# EasyEDA Pro project Ai-Camera.eprj, board PCB1
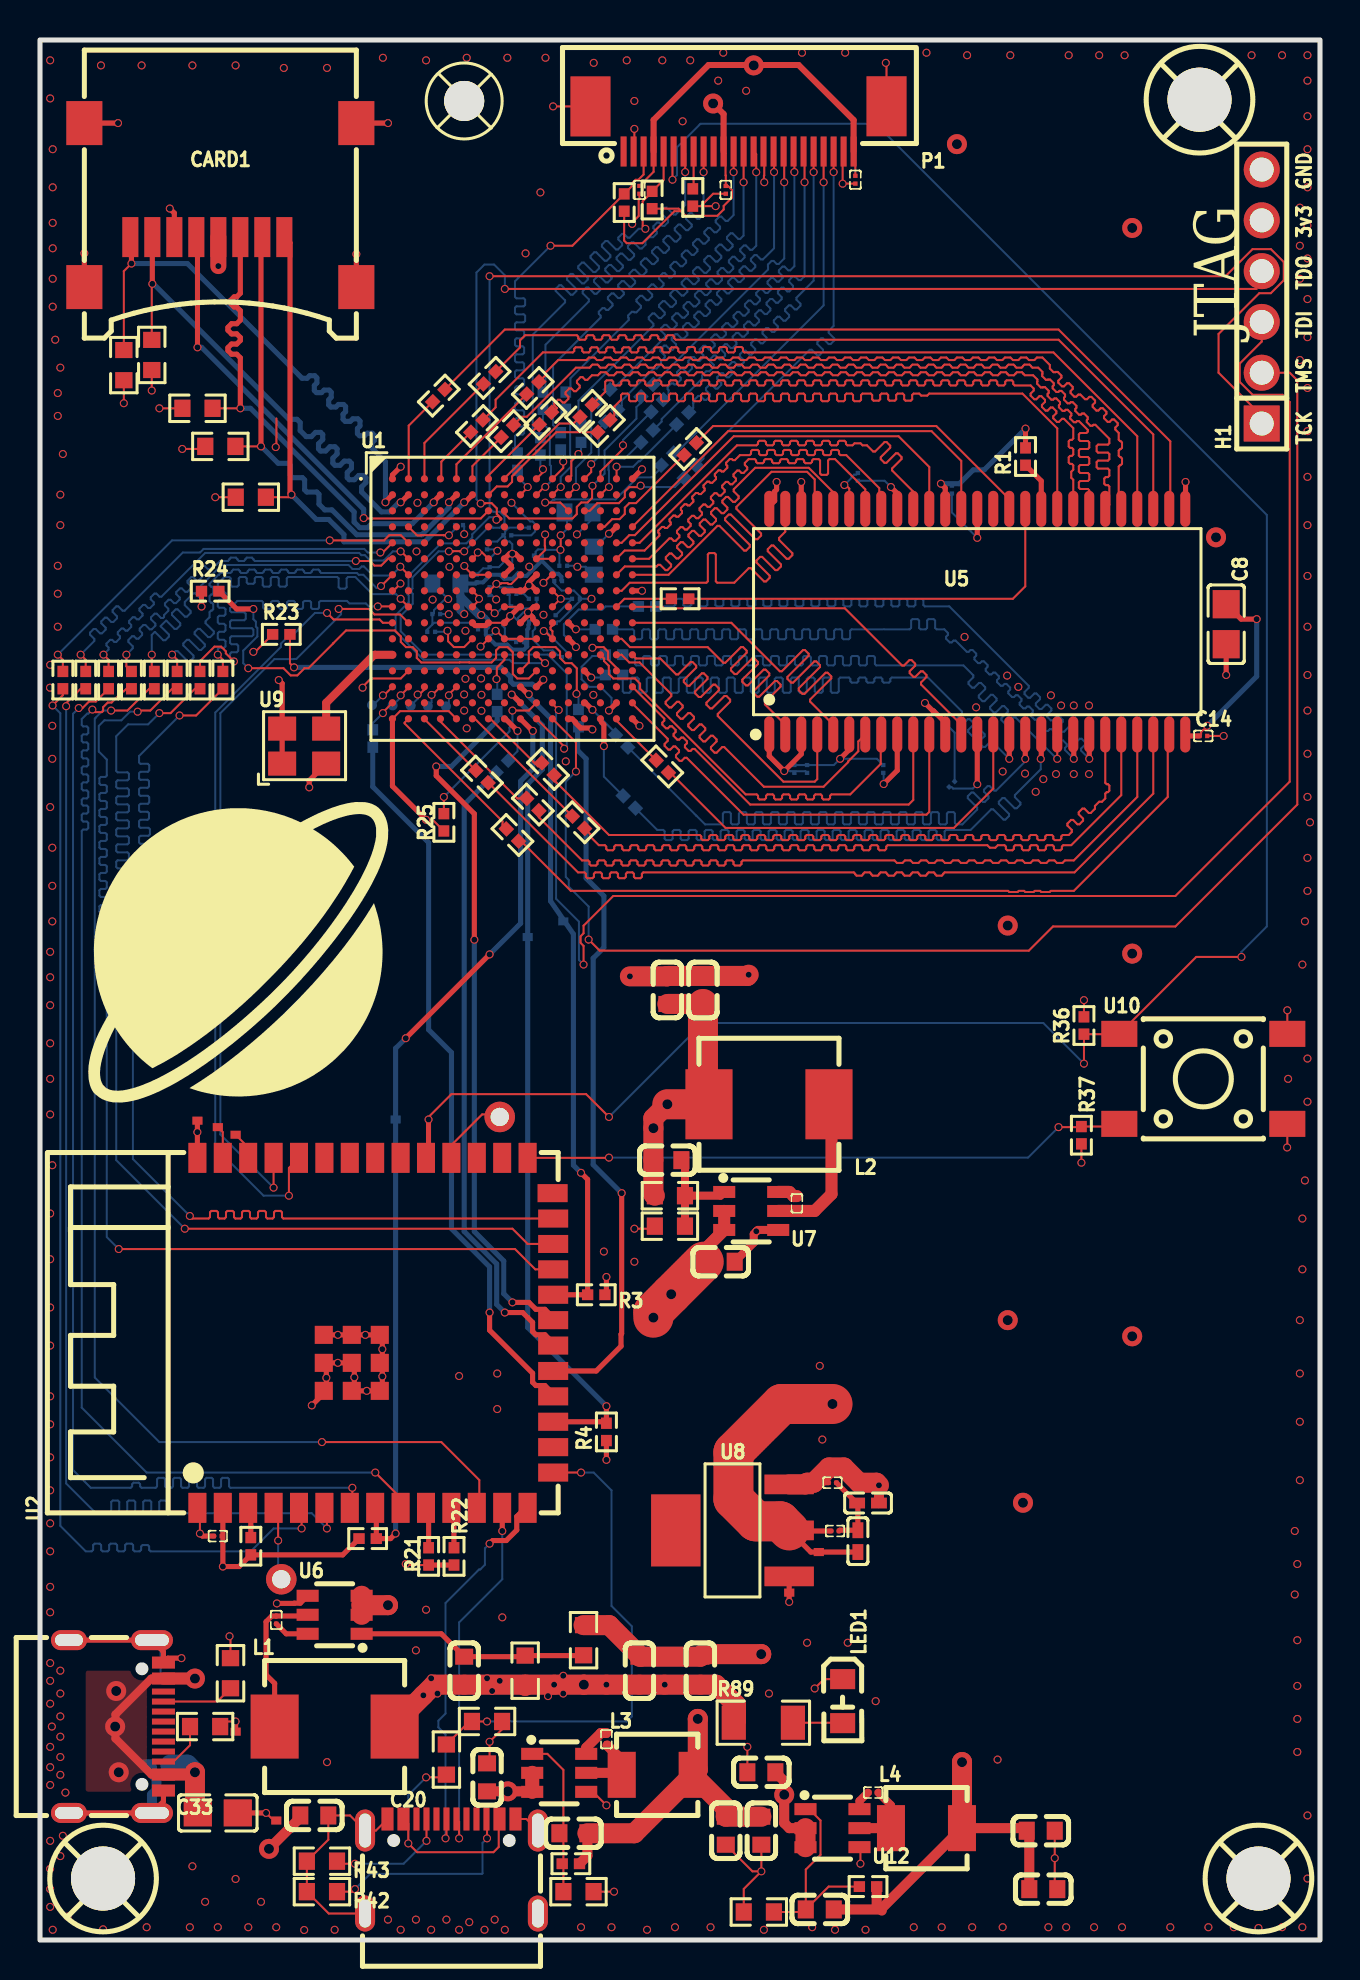
[diagram p2: board, top side]
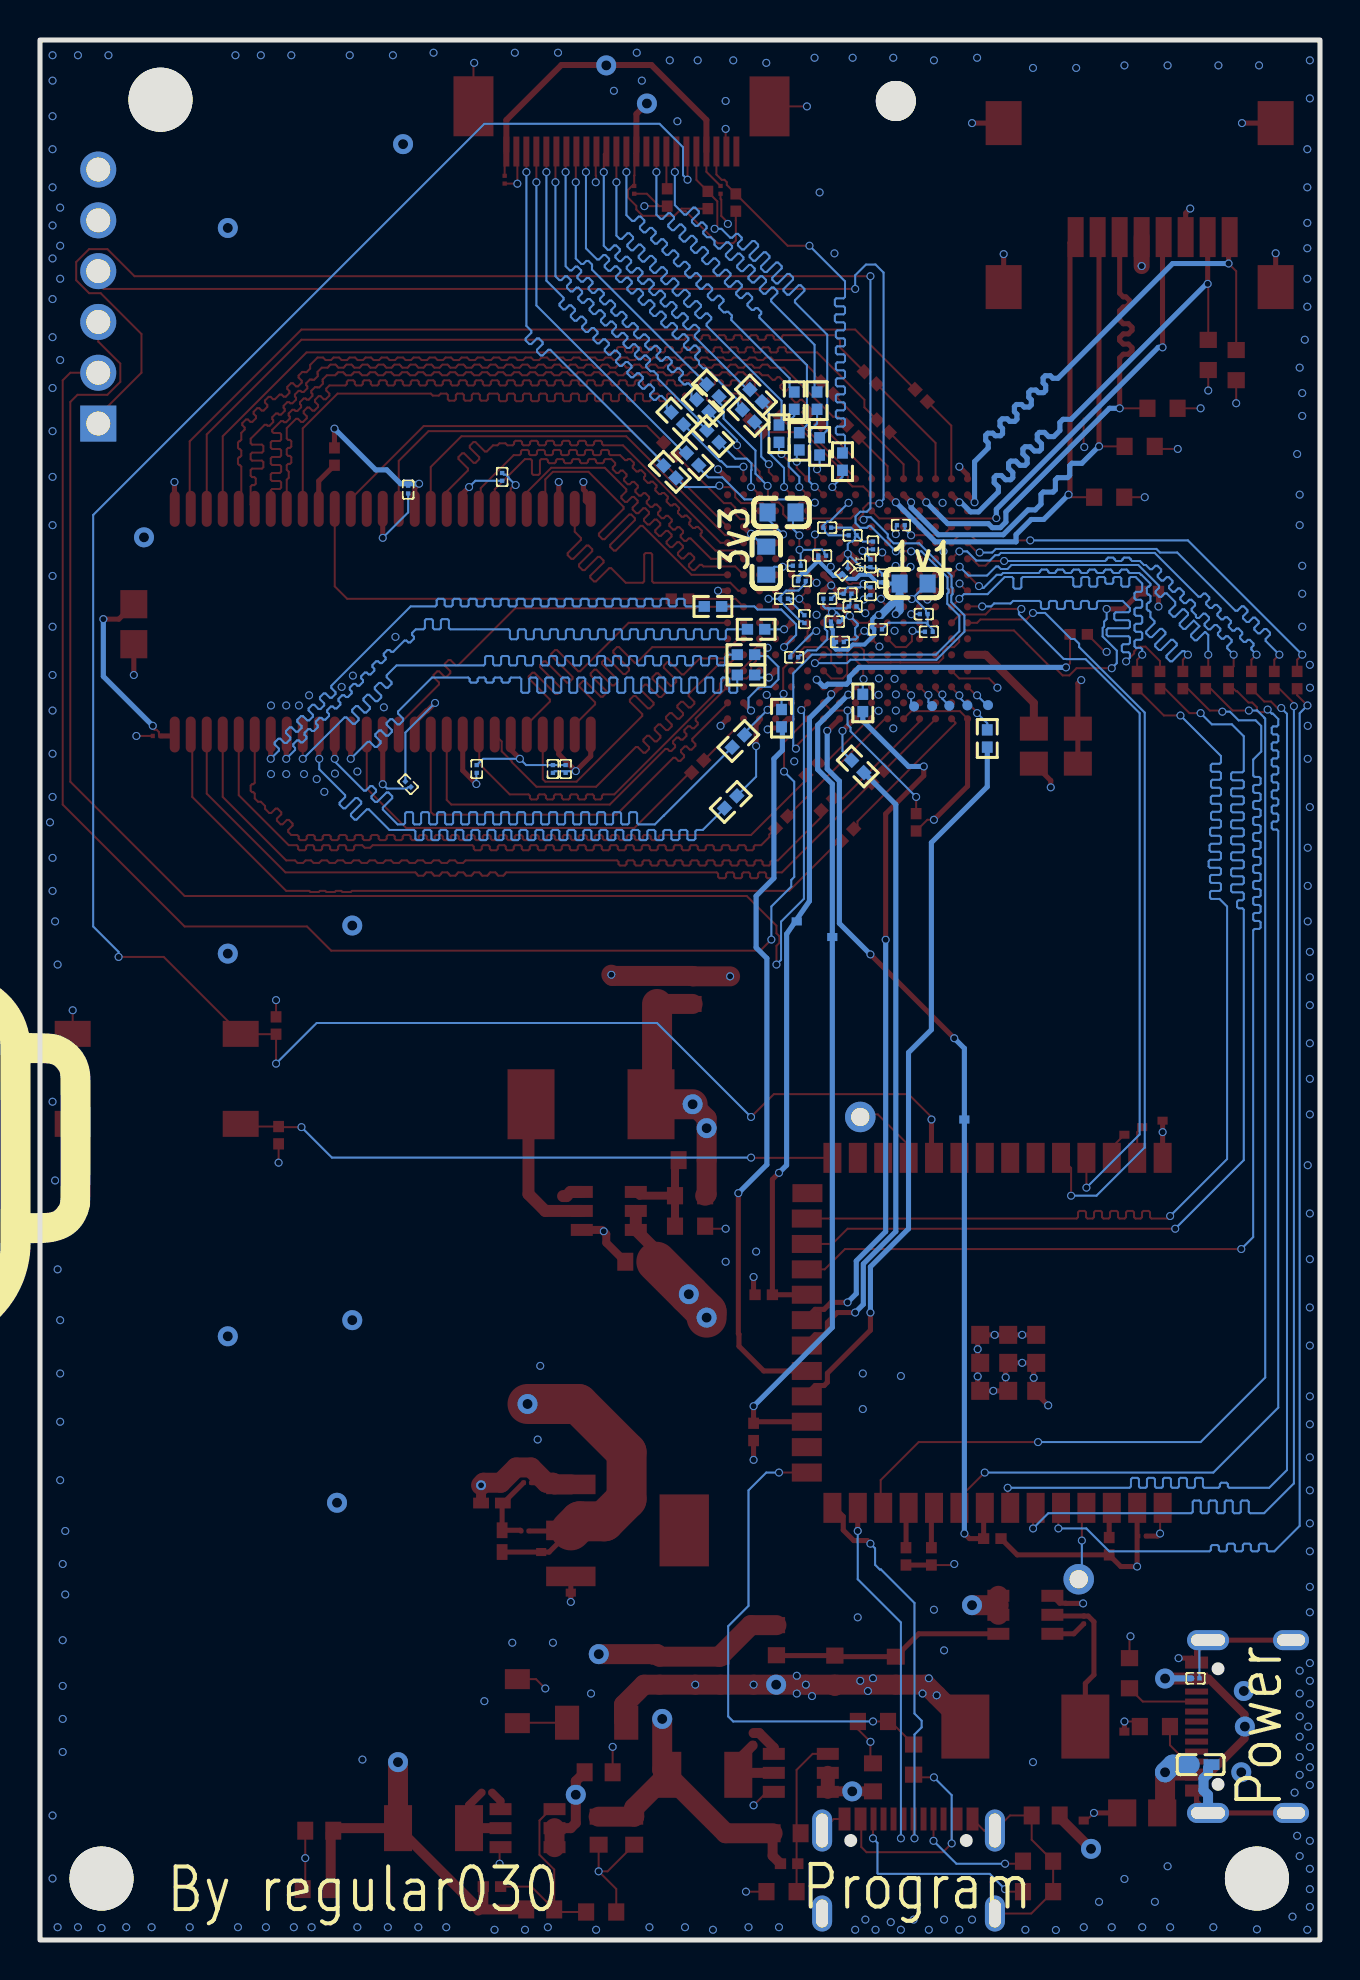
[diagram p3: board, bottom side, seen from below]

Outline 64 x 95 mm; copper layers: Top Layer, Inner1, Inner2, Inner3, Inner4, Bottom Layer. Coordinates in mm from the lower left corner of the outline.
Outline path: rectangle 0,95 64,0
Stack: Top Layer 0.035mm Outer layer thickness 1oz / Dielectric1 0.0994mm 3313 RC57% 4.2mil / Inner1 0.0152mm Inner layer thickness / Dielectric2 0.55mm 0.55mm H/H No copper / Inner2 0.0152mm Inner layer thickness / Dielectric3 0.1088mm 2116 RC54% 4.9mil / Inner3 0.0152mm Inner layer thickness / Dielectric4 0.55mm 0.55mm H/H No copper / Inner4 0.0152mm Inner layer thickness / Dielectric5 0.0994mm 3313 RC57% 4.2mil / Bottom Layer 0.035mm Outer layer thickness 1oz

## Design rules (mm)
template: Custom Config
spacing copperThickness1oz (default): track to track 0.1, other pairs 0.152 to 0.3
spacing copperThickness2oz: track to track 0.203, other pairs 0.152 to 0.3
track width copperThickness1oz (default): min 0.1, default 0.1, max 2.54
track width copperThickness2oz: min 0.203, default 0.254, max 2.54
differential pair differentialPair (default): width min 0.127, default 0.254, max 2.54; gap min 0.152, default 0.152
via viaSize (default): diameter min 0.4, default 0.4, max 10; hole min 0.3, default 0.3, max 6.3

## Placement (name value [footprint] x y rotation side)
C8  47uF  [C0805]  59.31 65.79 270 top
C10  100nF  [C01005]  37.72 58.55 90 bottom
C11  100nF  [C01005]  38.35 58.55 90 bottom
C12  100nF  [C01005]  42.16 58.55 90 bottom
C13  100nF  [C01005]  45.59 57.79 45 bottom
C14  100nF  [C01005]  58.17 60.2 0 top
C15  100nF  [C01005]  45.59 72.52 90 bottom
C16  100nF  [C01005]  40.89 73.16 90 bottom
C17  100nF  [C01005]  8.89 20.2 0 top
C18  100nF  [C01005]  11.81 16.01 90 top
C19  100nF  [C0603]  21.21 13.47 270 top
C20  22uF  [C0603]  13.72 6.23 180 top
C22  22uF  [C0603]  33.02 13.47 270 top
C23  22uF  [C0603]  29.97 13.47 270 top
C24  100nF  [C01005]  37.85 36.83 270 top
C25  100nF  [C0603]  31.37 38.99 180 top
C26  22uF  [C0603]  34.04 33.91 180 top
C27  22uF  [C0603]  31.37 47.5 270 top
C28  22uF  [C0603]  33.15 47.5 270 top
C29  100nF  [C01005]  39.75 20.45 0 top
C30  100nF  [C01005]  39.62 22.86 0 top
C31  10uF  [C0402]  41.4 21.85 0 top
C32  10uF  [C0402]  40.89 19.94 270 top
C33  47uF  [C0805]  8.89 6.35 180 top
C34  100nF  [C01005]  29.97 87.51 270 top
C35  100nF  [C01005]  34.29 87.51 270 top
C37  100nF  [C01005]  20.96 70.74 180 bottom
C39  100nF  [C01005]  24.64 70.62 180 bottom
C40  100nF  [C01005]  26.16 68.71 180 bottom
C41  100nF  [C01005]  21.84 68.08 90 bottom
C42  100nF  [C01005]  23.75 68.46 135 bottom
C43  100nF  [C01005]  24.89 69.22 180 bottom
C44  100nF  [C01005]  25.91 67.95 180 bottom
C45  100nF  [C01005]  22.48 67.44 270 bottom
C46  100nF  [C01005]  23.62 67.31 180 bottom
C47  100nF  [C01005]  24.64 67.06 0 bottom
C48  100nF  [C01005]  26.29 64.14 180 bottom
C49  100nF  [C01005]  24.26 65.92 180 bottom
C50  100nF  [C01005]  23.37 70.23 180 bottom
C51  100nF  [C01005]  19.56 65.41 180 bottom
C52  100nF  [C01005]  25.78 66.04 270 bottom
C53  100nF  [C01005]  24 64.9 180 bottom
C54  100nF  [C01005]  22.1 65.54 180 bottom
C55  100nF  [C01005]  26.8 67.06 0 bottom
C56  100nF  [C01005]  19.81 66.3 180 bottom
C57  100nF  [C01005]  23.37 66.68 0 bottom
C58  22uF  [C0603]  26.92 71.38 180 bottom
C59  22uF  [C0603]  27.69 68.97 90 bottom
C61  22uF  [C0603]  20.32 67.82 180 bottom
C62  100nF  [C01005]  22.48 68.84 270 bottom
C63  100nF  [C01005]  22.35 69.73 90 bottom
C64  100nF  [C01005]  28.32 10.04 270 top
C65  100nF  [C0603]  26.67 5.34 0 top
C66  22uF  [C0603]  22.35 8.13 270 top
C67  22uF  [C0603]  36.07 5.47 90 top
C68  22uF  [C0603]  34.29 5.47 90 top
C69  100nF  [C01005]  41.66 7.37 0 top
C70  100nF  [C0603]  38.99 1.53 0 top
C71  22uF  [C0603]  36.07 8.39 0 top
C72  22uF  [C0603]  50.16 2.54 180 top
C73  22uF  [C0603]  50.04 5.47 180 top
C74  100nF  [C01005]  40.77 88.02 270 top
C75  10uF  [C0402]  5.97 8.77 0 bottom
C76  100nF  [C01005]  6.22 13.09 180 bottom
CARD1  DS1139-06-08SS4BSR  [TF-SMD_DS1139-06-08SS4BSR]  9.02 86.75 0 top
H1  2.54-1x6P直针  [HDR-TH_6P-P2.54-V-M-1]  61.09 82.17 90 top
L1  6.8uH  [IND-SMD_L7.0-W6.6]  14.73 10.67 0 top
L2  10uH  [IND-SMD_L7.3-W6.8]  36.45 41.79 180 top
L3  3.3uH  [IND-SMD_L4.5-W4.1_SL0420]  30.86 8.26 0 top
L4  3.3uH  [IND-SMD_L4.5-W4.1_SL0420]  44.32 5.59 0 top
LED1  -  [LED0805-RD_RED]  40.13 11.94 270 top
NOREF  -  [Pad_e261]  9.78 40.26 0 top
NOREF#2  -  [Pad_e5119]  24.38 50.15 0 top
NOREF#3  -  [Pad_e16]  22.99 41.15 0 top
NOREF#4  -  [Pad_e5128]  17.78 41.03 0 top
NOREF#5  -  [Pad_e5113]  26.16 50.93 0 top
NOREF#6  -  [Pad_e251]  8.89 40.64 0 top
NOREF#7  -  [Pad_e5133]  7.87 40.97 0 top
NOREF#8  -  [Pad_e5188]  37.46 17.37 0 top
NOREF#9  -  [Pad_e5182]  38.94 19.4 0 top
NOREF#10  -  [Pad_e5178]  11.81 5.97 0 top
NOREF#11  -  [Pad_e126]  12.06 18.04 0 top
NOREF#12  -  [Pad_e5171]  9.78 10.42 0 top
P1  AFC07-S24FCC-00  [FPC-SMD_AFC07-S24FCC-00]  34.93 90.56 180 top
R1  10kΩ  [R0402]  49.28 74.17 90 top
R2  33Ω  [R0402]  32 67.06 180 top
R3  10kΩ  [R0402]  27.81 32.26 180 top
R4  10kΩ  [R0402]  28.32 25.4 90 top
R5  10kΩ  [R0402]  16.38 20.07 180 top
R6  33Ω  [R0402]  26.92 61.09 270 bottom
R7  10kΩ  [R0402]  10.54 19.69 270 top
R9  5.1kΩ  [R0603]  9.53 13.34 270 top
R10  5.1kΩ  [R0603]  8.25 10.67 180 top
R11  196kΩ  [R0603]  24.26 13.47 270 top
R12  62kΩ  [R0603]  27.18 14.99 270 top
R14  62kΩ  [R0603]  31.5 35.69 0 top
R15  23.2kΩ  [R0603]  31.5 37.22 180 top
R16  62kΩ  [R0603]  10.54 72.14 180 top
R17  62kΩ  [R0603]  9.02 74.68 180 top
R18  62kΩ  [R0603]  5.59 79.25 270 top
R19  62kΩ  [R0603]  4.19 78.74 270 top
R20  62kΩ  [R0603]  7.87 76.58 180 top
R21  10kΩ  [R0402]  19.43 19.18 270 top
R22  10kΩ  [R0402]  20.7 19.18 270 top
R23  10kΩ  [R0402]  12.06 65.28 0 top
R24  10kΩ  [R0402]  8.51 67.44 0 top
R25  10kΩ  [R0402]  20.19 55.88 90 top
R26  33Ω  [R0402]  1.14 63 270 top
R27  33Ω  [R0402]  2.29 63 270 top
R28  33Ω  [R0402]  3.43 63 270 top
R29  33Ω  [R0402]  4.57 63 270 top
R30  33Ω  [R0402]  5.72 63 270 top
R31  33Ω  [R0402]  6.86 63 270 top
R32  33Ω  [R0402]  8 63 270 top
R34  33Ω  [R0402]  9.14 63 270 top
R35  10kΩ  [R0402]  32.64 87.13 270 top
R36  10kΩ  [R0402]  52.2 45.72 90 top
R37  10kΩ  [R0402]  52.07 40.24 270 top
R38  10kΩ  [R0402]  29.21 86.87 270 top
R39  10kΩ  [R0402]  30.61 87 270 top
R40  62kΩ  [R0603]  26.92 2.42 180 top
R41  130kΩ  [R0402]  26.54 3.81 0 top
R42  5.1kΩ  [R0603]  14.1 2.42 180 top
R43  5.1kΩ  [R0603]  14.1 3.94 180 top
R44  196kΩ  [R0603]  20.32 9.02 270 top
R45  196kΩ  [R0603]  22.35 10.93 180 top
R46  62kΩ  [R0603]  35.94 1.4 0 top
R47  154kΩ  [R0402]  41.4 2.67 0 top
R48  33Ω  [R0402]  28.7 63.25 0 bottom
R49  33Ω  [R0402]  29.08 59.95 315 bottom
R50  33Ω  [R0402]  29.46 56.9 315 bottom
R51  33Ω  [R0402]  28.7 64.27 0 bottom
R53  33Ω  [R0402]  30.35 66.68 0 bottom
R54  33Ω  [R0402]  28.19 65.54 0 bottom
R55  33Ω  [R0402]  25.4 58.55 315 top
R56  33Ω  [R0402]  26.92 55.88 315 top
R57  33Ω  [R0402]  24.64 56.77 315 top
R58  33Ω  [R0402]  22.1 58.17 315 top
R59  33Ω  [R0402]  23.62 55.25 315 top
R61  33Ω  [R0402]  28.19 75.7 225 top
R62  33Ω  [R0402]  27.31 76.46 225 top
R63  33Ω  [R0402]  25.27 76.08 225 top
R64  33Ω  [R0402]  23.37 75.44 225 top
R65  33Ω  [R0402]  24.64 77.6 225 top
R66  33Ω  [R0402]  21.84 75.7 225 top
R67  33Ω  [R0402]  22.48 78.11 225 top
R68  33Ω  [R0402]  19.94 77.22 225 top
R69  33Ω  [R0402]  31.12 58.68 315 top
R70  33Ω  [R0402]  32.51 74.55 225 top
R71  33Ω  [R0402]  23.88 73.92 90 bottom
R72  33Ω  [R0402]  25.02 74.68 90 bottom
R73  33Ω  [R0402]  25.15 76.97 90 bottom
R75  33Ω  [R0402]  26.03 74.93 90 bottom
R76  33Ω  [R0402]  26.29 76.97 90 bottom
R77  33Ω  [R0402]  27.05 75.31 90 bottom
R78  33Ω  [R0402]  28.19 77.22 45 bottom
R79  33Ω  [R0402]  28.57 76.2 45 bottom
R80  33Ω  [R0402]  30.35 77.47 45 bottom
R81  33Ω  [R0402]  30.86 76.71 45 bottom
R82  33Ω  [R0402]  30.35 75.19 45 bottom
R83  33Ω  [R0402]  32.13 76.08 45 bottom
R84  33Ω  [R0402]  31.37 74.05 45 bottom
R85  33Ω  [R0402]  32.51 73.41 45 bottom
R86  33Ω  [R0402]  16.64 60.08 270 bottom
R87  33Ω  [R0402]  23.11 58.68 225 bottom
R88  33Ω  [R0402]  22.86 61.85 270 bottom
R89  1kΩ  [R1206]  36.17 10.86 0 top
SCREW1  -  [Screw-Hole-M2]  21.21 91.95 0 top
SCREW2  -  [Screw-Hole-M3]  60.99 3.01 0 top
SCREW3  -  [Screw-Hole-M3]  58.04 91.95 0 top
SCREW4  -  [Screw-Hole-M3]  3.22 3.01 0 top
TP1  -  [Test-Point-0.5mm]  16.6 61.74 180 bottom
TP2  -  [Test-Point-0.5mm]  17.63 61.73 180 bottom
TP3  -  [Test-Point-0.5mm]  18.54 61.71 180 bottom
TP4  -  [Test-Point-0.5mm]  19.39 61.7 180 bottom
TP6  -  [Test-Point-0.5mm]  20.3 61.68 180 bottom
U1  LFE5U-25F-6BG256C  [CABGA-256_L14.0-W14.0-R16-C16-P0.80-TL]  23.62 67.06 0 top
U2  ESP32-S3-WROOM-1-N16R2  [WIRELM-SMD_ESP32-S3-WROOM-1]  16.76 30.36 90 top
U5  W9825G6KH-6  [TSOP-54_L22.2-W10.2-P0.80-LS11.8-BL]  46.86 65.92 0 top
U6  AP63200WU-7  [SOT-23-6_L2.9-W1.6-P0.95-LS2.8-BR]  14.73 16.26 0 top
U7  AP63200WU-7  [SOT-23-6_L2.9-W1.6-P0.95-LS2.8-BR]  35.56 36.45 180 top
U8  AMS1117-1.8  [SOT-223-4_L6.5-W3.5-P2.30-LS7.0-BR]  34.62 20.48 0 top
U9  24MHz  [OSC-SMD_4P-L3.2-W2.5-BL]  13.21 59.69 0 top
U10  TPS645-5NC60  [SW-SMD_4P-L6.0-W6.0-P4.50-LS9.2]  58.17 43.06 0 top
U11  AP63200WU-7  [SOT-23-6_L2.9-W1.6-P0.95-LS2.8-BR]  25.96 8.36 180 top
U12  AP63200WU-7  [SOT-23-6_L2.9-W1.6-P0.95-LS2.8-BR]  39.62 5.59 180 top
USB1  TYPE-C16PIN  [USB-C-SMD_TYPE-C16PIN]  3.81 10.67 270 top
USB2  TYPE-C16PIN  [USB-C-SMD_TYPE-C16PIN]  20.57 3.69 0 top

## Footprints (pads in the part's own frame, mm; a bottom-side part is the same pattern mirrored in y, then rotated)
C0402
  rect 0.79x0.54 smd: 1(-0.545,0) 2(0.545,0)
C0603
  rect 0.8x0.9 smd: 1(-0.7,0) 2(0.7,0)
C0805
  rect 1.41x1.35 smd: 1(-1,0) 2(1,0)
C01005
  rect 0.21x0.22 smd: 1(-0.195,0) 2(0.195,0)
CABGA-256_L14.0-W14.0-R16-C16-P0.80-TL
  round 0.36 smd: A1(-6,6) A2(-5.2,6) A3(-4.4,6) A4(-3.6,6) A5(-2.8,6) A6(-2,6) A7(-1.2,6) A8(-0.4,6) A9(0.4,6) A10(1.2,6) A11(2,6) A12(2.8,6) A13(3.6,6) A14(4.4,6) A15(5.2,6) A16(6,6) B1(-6,5.2) B2(-5.2,5.2) B3(-4.4,5.2) B4(-3.6,5.2) B5(-2.8,5.2) B6(-2,5.2) B7(-1.2,5.2) B8(-0.4,5.2) B9(0.4,5.2) B10(1.2,5.2) B11(2,5.2) B12(2.8,5.2) B13(3.6,5.2) B14(4.4,5.2) B15(5.2,5.2) B16(6,5.2) C1(-6,4.4) C2(-5.2,4.4) C3(-4.4,4.4) C4(-3.6,4.4) C5(-2.8,4.4) C6(-2,4.4) C7(-1.2,4.4) C8(-0.4,4.4) C9(0.4,4.4) C10(1.2,4.4) C11(2,4.4) C12(2.8,4.4) C13(3.6,4.4) C14(4.4,4.4) C15(5.2,4.4) C16(6,4.4) D1(-6,3.6) D2(-5.2,3.6) D3(-4.4,3.6) D4(-3.6,3.6) D5(-2.8,3.6) D6(-2,3.6) D7(-1.2,3.6) D8(-0.4,3.6) D9(0.4,3.6) D10(1.2,3.6) D11(2,3.6) D12(2.8,3.6) D13(3.6,3.6) D14(4.4,3.6) D15(5.2,3.6) D16(6,3.6) E1(-6,2.8) E2(-5.2,2.8) E3(-4.4,2.8) E4(-3.6,2.8) E5(-2.8,2.8) E6(-2,2.8) E7(-1.2,2.8) E8(-0.4,2.8) E9(0.4,2.8) E10(1.2,2.8) E11(2,2.8) E12(2.8,2.8) E13(3.6,2.8) E14(4.4,2.8) E15(5.2,2.8) E16(6,2.8) F1(-6,2) F2(-5.2,2) F3(-4.4,2) F4(-3.6,2) F5(-2.8,2) F6(-2,2) F7(-1.2,2) F8(-0.4,2) F9(0.4,2) F10(1.2,2) F11(2,2) F12(2.8,2) F13(3.6,2) F14(4.4,2) F15(5.2,2) F16(6,2) G1(-6,1.2) G2(-5.2,1.2) G3(-4.4,1.2) G4(-3.6,1.2) G5(-2.8,1.2) G6(-2,1.2) G7(-1.2,1.2) G8(-0.4,1.2) G9(0.4,1.2) G10(1.2,1.2) G11(2,1.2) G12(2.8,1.2) G13(3.6,1.2) G14(4.4,1.2) G15(5.2,1.2) G16(6,1.2) H1(-6,0.4) H2(-5.2,0.4) H3(-4.4,0.4) H4(-3.6,0.4) H5(-2.8,0.4) H6(-2,0.4) H7(-1.2,0.4) H8(-0.4,0.4) H9(0.4,0.4) H10(1.2,0.4) H11(2,0.4) H12(2.8,0.4) H13(3.6,0.4) H14(4.4,0.4) H15(5.2,0.4) H16(6,0.4) J1(-6,-0.4) J2(-5.2,-0.4) J3(-4.4,-0.4) J4(-3.6,-0.4) J5(-2.8,-0.4) J6(-2,-0.4) J7(-1.2,-0.4) J8(-0.4,-0.4) J9(0.4,-0.4) J10(1.2,-0.4) J11(2,-0.4) J12(2.8,-0.4) J13(3.6,-0.4) J14(4.4,-0.4) J15(5.2,-0.4) J16(6,-0.4) K1(-6,-1.2) K2(-5.2,-1.2) K3(-4.4,-1.2) K4(-3.6,-1.2) K5(-2.8,-1.2) K6(-2,-1.2) K7(-1.2,-1.2) K8(-0.4,-1.2) K9(0.4,-1.2) K10(1.2,-1.2) K11(2,-1.2) K12(2.8,-1.2) K13(3.6,-1.2) K14(4.4,-1.2) K15(5.2,-1.2) K16(6,-1.2) L1(-6,-2) L2(-5.2,-2) L3(-4.4,-2) L4(-3.6,-2) L5(-2.8,-2) L6(-2,-2) L7(-1.2,-2) L8(-0.4,-2) L9(0.4,-2) L10(1.2,-2) L11(2,-2) L12(2.8,-2) L13(3.6,-2) L14(4.4,-2) L15(5.2,-2) L16(6,-2) M1(-6,-2.8) M2(-5.2,-2.8) M3(-4.4,-2.8) M4(-3.6,-2.8) M5(-2.8,-2.8) M6(-2,-2.8) M7(-1.2,-2.8) M8(-0.4,-2.8) M9(0.4,-2.8) M10(1.2,-2.8) M11(2,-2.8) M12(2.8,-2.8) M13(3.6,-2.8) M14(4.4,-2.8) M15(5.2,-2.8) M16(6,-2.8) N1(-6,-3.6) N2(-5.2,-3.6) N3(-4.4,-3.6) N4(-3.6,-3.6) N5(-2.8,-3.6) N6(-2,-3.6) N7(-1.2,-3.6) N8(-0.4,-3.6) N9(0.4,-3.6) N10(1.2,-3.6) N11(2,-3.6) N12(2.8,-3.6) N13(3.6,-3.6) N14(4.4,-3.6) N15(5.2,-3.6) N16(6,-3.6) P1(-6,-4.4) P2(-5.2,-4.4) P3(-4.4,-4.4) P4(-3.6,-4.4) P5(-2.8,-4.4) P6(-2,-4.4) P7(-1.2,-4.4) P8(-0.4,-4.4) P9(0.4,-4.4) P10(1.2,-4.4) P11(2,-4.4) P12(2.8,-4.4) P13(3.6,-4.4) P14(4.4,-4.4) P15(5.2,-4.4) P16(6,-4.4) R1(-6,-5.2) R2(-5.2,-5.2) R3(-4.4,-5.2) R4(-3.6,-5.2) R5(-2.8,-5.2) R6(-2,-5.2) R7(-1.2,-5.2) R8(-0.4,-5.2) R9(0.4,-5.2) R10(1.2,-5.2) R11(2,-5.2) R12(2.8,-5.2) R13(3.6,-5.2) R14(4.4,-5.2) R15(5.2,-5.2) R16(6,-5.2) T1(-6,-6) T2(-5.2,-6) T3(-4.4,-6) T4(-3.6,-6) T5(-2.8,-6) T6(-2,-6) T7(-1.2,-6) T8(-0.4,-6) T9(0.4,-6) T10(1.2,-6) T11(2,-6) T12(2.8,-6) T13(3.6,-6) T14(4.4,-6) T15(5.2,-6) T16(6,-6)
FPC-SMD_AFC07-S24FCC-00
  rect 0.3x1.5 smd: 1(5.745,1.129) 2(5.245,1.129) 3(4.745,1.129) 4(4.245,1.129) 5(3.745,1.129) 6(3.245,1.129) 7(2.745,1.129) 8(2.245,1.129) 9(1.746,1.129) 10(1.246,1.129) 11(0.746,1.129) 12(0.245,1.129) 13(-0.255,1.129) 14(-0.754,1.129) 15(-1.25,1.13) 16(-1.754,1.129) 17(-2.254,1.129) 18(-2.753,1.129) 19(-3.253,1.129) 20(-3.756,1.132) 21(-4.256,1.132) 22(-4.756,1.132) 23(-5.256,1.132) 24(-5.756,1.132)
  rect 2x3 smd: 25(-7.401,-1.132) 26(7.401,-1.125)
HDR-TH_6P-P2.54-V-M-1
  rect 1.8x1.8 hole 1.2: 1(-6.35,0)
  round 1.8 hole 1.2: 2(-3.81,0) 3(-1.27,0) 4(1.27,0) 5(3.81,0) 6(6.35,0)
IND-SMD_L4.5-W4.1_SL0420
  rect 1.4x2.3 smd: 1(-1.775,0) 2(1.775,0)
IND-SMD_L7.0-W6.6
  rect 2.4x3.2 smd: 1(-3,0) 2(3,0)
IND-SMD_L7.3-W6.8
  rect 2.35x3.5 smd: 1(-3,0) 2(3,0)
LED0805-RD_RED
  rect 1x1.25 smd: 1(-1.1,0) 2(1.1,0)
OSC-SMD_4P-L3.2-W2.5-BL
  rect 1.4x1.2 smd: 1(-1.1,-0.875) 2(1.1,-0.875) 3(1.1,0.875) 4(-1.1,0.875)
Pad_e16
  round 1.524 hole 0.914: 1(0,0)
Pad_e126
  round 1.524 hole 0.914: 1(0,0)
Pad_e251
  custom 0.513x0.401 smd: 55(0,0)
Pad_e261
  custom 0.513x0.401 smd: 55(0,0)
Pad_e5113
  custom 0.513x0.401 smd far side: 55(0,0)
Pad_e5119
  custom 0.513x0.402 smd far side: 55(0,0)
Pad_e5128
  custom 0.513x0.401 smd far side: 55(0,0)
Pad_e5133
  custom 0.513x0.402 smd: 55(0,0)
Pad_e5171
  custom 0.513x0.401 smd: 55(0,0)
Pad_e5178
  custom 0.513x0.401 smd: 55(0,0)
Pad_e5182
  custom 0.513x0.401 smd: 55(0,0)
Pad_e5188
  custom 0.514x0.402 smd: 55(0,0)
R0402
  rect 0.566x0.54 smd: 1(-0.433,0) 2(0.433,0)
R0603
  rect 0.806x0.864 smd: 1(-0.753,0) 2(0.753,0)
R1206
  rect 1.208x1.701 smd: 1(-1.479,0) 2(1.479,0)
Screw-Hole-M2
  round 2 hole 2: 1(0,0)
Screw-Hole-M3
  round 3.2 hole 3.2: 1(-0.064,0.064)
SOT-23-6_L2.9-W1.6-P0.95-LS2.8-BR
  rect 1.1x0.6 smd: 1(1.35,-0.95) 2(1.35,0) 3(1.35,0.95) 4(-1.35,0.95) 5(-1.35,0) 6(-1.35,-0.95)
SOT-223-4_L6.5-W3.5-P2.30-LS7.0-BR
  rect 2.47x0.98 smd: 1(2.835,-2.3) 2(2.835,0) 3(2.835,2.3)
  rect 2.47x3.6 smd: 4(-2.835,0)
SW-SMD_4P-L6.0-W6.0-P4.50-LS9.2
  rect 1.8x1.3 smd: 1(-4.2,2.25) 2(4.2,2.25) 3(-4.2,-2.25) 4(4.2,-2.25)
Test-Point-0.5mm
  round 0.5 smd: 1(0,0)
TF-SMD_DS1139-06-08SS4BSR
  rect 0.8x2 smd: 1(3.2,-1.6) 2(2.1,-1.6) 3(1,-1.6) 4(-0.1,-1.6) 5(-1.2,-1.6) 6(-2.3,-1.6) 7(-3.4,-1.6) 8(-4.5,-1.6)
  rect 1.8x2.2 smd: 9(-6.8,4.1) 10(-6.8,-4.1) 11(6.8,-4.1) 12(6.8,4.1)
TSOP-54_L22.2-W10.2-P0.80-LS11.8-BL
  oval 0.5x1.8 smd: 1(-10.4,-5.642) 2(-9.6,-5.642) 3(-8.8,-5.642) 4(-8,-5.642) 5(-7.2,-5.642) 6(-6.4,-5.642) 7(-5.6,-5.642) 8(-4.8,-5.642) 9(-4,-5.642) 10(-3.2,-5.642) 11(-2.4,-5.642) 12(-1.6,-5.642) 13(-0.8,-5.642) 14(0,-5.642) 15(0.8,-5.642) 16(1.6,-5.642) 17(2.4,-5.642) 18(3.2,-5.642) 19(4,-5.642) 20(4.8,-5.642) 21(5.6,-5.642) 22(6.4,-5.642) 23(7.2,-5.642) 24(8,-5.642) 25(8.8,-5.642) 26(9.6,-5.642) 27(10.4,-5.642) 28(10.4,5.642) 29(9.6,5.642) 30(8.8,5.642) 31(8,5.642) 32(7.2,5.642) 33(6.4,5.642) 34(5.6,5.642) 35(4.8,5.642) 36(4,5.642) 37(3.2,5.642) 38(2.4,5.642) 39(1.6,5.642) 40(0.8,5.642) 41(0,5.642) 42(-0.8,5.642) 43(-1.6,5.642) 44(-2.4,5.642) 45(-3.2,5.642) 46(-4,5.642) 47(-4.8,5.642) 48(-5.6,5.642) 49(-6.4,5.642) 50(-7.2,5.642) 51(-8,5.642) 52(-8.8,5.642) 53(-9.6,5.642) 54(-10.4,5.642)
USB-C-SMD_TYPE-C16PIN
  oval 1x2.1 hole 0.6x1.7: 1(-4.32,1.788) 2(4.32,1.788)
  oval 1x1.8 hole 0.6x1.4: 3(-4.32,-2.362) 4(4.32,-2.362)
  rect 0.6x1.15 smd: A1B12(-3.2,2.362) A4B9(-2.4,2.362) B1A12(3.2,2.362) B4A9(2.4,2.362)
  rect 0.3x1.15 smd: A5(-1.25,2.362) A6(-0.25,2.362) A7(0.25,2.362) A8(1.25,2.362) B5(1.75,2.362) B6(0.75,2.362) B7(-0.75,2.362) B8(-1.75,2.362)
WIRELM-SMD_ESP32-S3-WROOM-1
  rect 1.5x0.9 smd: 1(-8.75,8.895) 2(-8.75,7.625) 3(-8.75,6.355) 4(-8.75,5.085) 5(-8.75,3.815) 6(-8.75,2.545) 7(-8.75,1.275) 8(-8.75,0.005) 9(-8.75,-1.265) 10(-8.75,-2.535) 11(-8.75,-3.805) 12(-8.75,-5.075) 13(-8.75,-6.345) 14(-8.75,-7.615) 27(8.75,-7.615) 28(8.75,-6.345) 29(8.75,-5.075) 30(8.75,-3.805) 31(8.75,-2.535) 32(8.75,-1.265) 33(8.75,0.005) 34(8.75,1.275) 35(8.75,2.545) 36(8.75,3.815) 37(8.75,5.085) 38(8.75,6.355) 39(8.75,7.625) 40(8.75,8.895)
  rect 0.9x1.5 smd: 15(-6.985,-8.895) 16(-5.715,-8.895) 17(-4.445,-8.895) 18(-3.175,-8.895) 19(-1.905,-8.895) 20(-0.635,-8.895) 21(0.635,-8.895) 22(1.905,-8.895) 23(3.175,-8.895) 24(4.445,-8.895) 25(5.715,-8.895) 26(6.985,-8.865)
  rect 0.9x0.9 smd: 41(-2.9,2.575) 41(-2.9,1.175) 41(-2.9,-0.225) 41(-1.5,2.575) 41(-1.5,1.175) 41(-1.5,-0.225) 41(-0.1,2.575) 41(-0.1,1.175) 41(-0.1,-0.225)

## Nets
As in the schematic, except:
+1V8: C29.1 C32.2 C35.1 C62.1 C63.1 NOREF#9.55 P1.11 R38.2 R39.2 U1.F10 U1.F11 U8.2
GND: C8.2 C10.2 C11.2 C12.2 C13.2 C14.2 C15.1 C16.1 C17.1 C20.1 C22.1 C23.1 C26.1 C27.1 C28.1 C33.1 C34.2 C35.2 C37.2 C39.2 C40.2 C41.2 C42.2 C43.2 C44.2 C45.2 C46.2 C47.2 C48.2 C49.2 C50.2 C51.2 C52.2 C53.2 C54.2 C55.2 C56.2 C57.2 C58.2 C59.2 C61.2 C62.2 C63.2 C66.1 C67.1 C68.1 C71.1 C72.1 C73.1 C74.2 C75.1 C76.2 CARD1.6 CARD1.9 CARD1.10 CARD1.11 CARD1.12 H1.6 LED1.1 NOREF#7.55 NOREF#8.55 NOREF#10.55 NOREF#12.55 P1.2 P1.15 P1.23 P1.25 P1.26 R9.1 R10.1 R12.1 R14.1 R24.1 R25.1 R35.2 R36.2 R37.2 R40.1 R42.2 R43.2 R45.1 R46.1 U1.A1 U1.A16 U1.D2 U1.D15 U1.F8 U1.F9 U1.G8 U1.G10 U1.H1 U1.H8 U1.H9 U1.H10 U1.H16 U1.J8 U1.J9 U1.J10 U1.K6 U1.K7 U1.K8 U1.K9 U1.K10 U1.N2 U1.N15 U1.T1 U1.T5 U1.T12 U1.T16 U2.1 U2.40 U2.41 U5.6 U5.12 U5.28 U5.41 U5.46 U5.52 U5.54 U6.4 U7.4 U8.1 U9.2 U10.2 U10.4 U11.4 U12.4 USB1.1 USB1.2 USB1.3 USB1.4 USB1.A1B12 USB1.B1A12 USB2.1 USB2.2 USB2.3 USB2.4 USB2.A1B12 USB2.B1A12
DONE: NOREF#5.55 R3.2 U1.P9 U2.22
INITN: NOREF#4.55 R5.1 U1.T9 U2.8
PROGRAMN: NOREF#2.55 R4.2 U1.R9 U2.17

Pads without a net: NOREF 55; NOREF#3 1; NOREF#6 55; NOREF#11 1; P1 1 10; SCREW1 1; SCREW2 1; SCREW3 1; SCREW4 1; U1 A9 B3 B8 B13 B15 B16 C1 C2 C3 C4 C5 C6 C9 C10 C11 C14 C15 C16 D1 D3 D4 D5 D6 D7 D8 D9 D10 D11 D12 D13 E3 E4 E5 E6 E7 E8 E9 E10 E11 E12 E13 E14 F3 F4 F5 F12 F13 F14 G3 G4 G5 G12 G13 G14 H2 H3 H4 H5 H12 H13 H14 J3 J4 J5 J12 J13 J14 K3 K4 K5 K13 K14 K15 L1 L2 L3 L4 L5 L13 L14 L16 M2 M3 M4 M5 M6 M7 M9 M11 M12 M13 N1 N3 N4 N5 N6 N7 N8 N11 N12 N14 N16 P6 P7 P8 P11 P12 P13 P14 P15 R2 R3 R4 R5 R6 R7 R8 R12 R14 T13; U2 4 16 26 28 29 30 32 33 34 35 38 39; U5 40; U8 4; USB1 A6 A7 A8 B6 B7 B8; USB2 A8 B6 B7 B8

## Via types
v1: diameter 0.4, hole 0.3, Top Layer to Bottom Layer, 516 vias
v2: diameter 1, hole 0.5, Top Layer to Bottom Layer, 28 vias
v3: diameter 0.5, hole 0.3, Top Layer to Bottom Layer, 1 via

## Routing (per net, layer and track width the routed paths; a pad name or vN(x,y) marks a point on that pad's centre or on a via; arc(x,y) is an arc through that point)
+1V1: length 32.9
  Top Layer w0.1: U1.G7 U1.G6 21.21,68.67 21.21,68.71 ; U1.L10 U1.L9 U1.L8 22.86,65.42 22.86,65.54
  Top Layer w1: v2(31.37,41.79) 30.67,41.09 C25.2 30.67,37.29 R15.2 ; C28.2 C27.2
  Top Layer w1.5: C28.2 33.15,42.09 L2.2 v2(31.37,41.79)
  Bottom Layer w0.1: 22.29,65.25 22.58,65.25 v1(22.78,65.46)
  Bottom Layer w0.2: 24.36,64.67 24.21,64.52 23.62,64.52 23.36,64.77 22.77,64.77 22.29,65.25 C54.1 22.39,65.63 22.39,66.05 22.28,66.15 22.28,66.16 22.19,66.25 v1(22.06,66.25) ; 24.36,64.67 24.32,64.71 24.32,64.77 C53.1 ; 24.36,64.67 24.36,65.52 24.42,65.58 24.42,65.76 24.45,65.79 ; 26.1,67.95 26.07,67.98 26.07,68.16 25.92,68.31 25.74,68.31 25.09,68.97 ; 25.09,68.97 24.32,68.2 24,68.2 23.89,68.32 23.63,68.06 23.21,68.06 23.01,68.26 22.53,68.26 22.15,67.88 C41.1 21.78,67.82 C61.1 21.02,67.29 ; 25.09,68.97 C43.1
  Bottom Layer w0.4: v1(22.06,66.25) 21.95,66.25 21.02,67.18 ; 21.02,67.29 21.02,67.18 ; 21.02,67.18 21.02,66.49 v1(21.21,66.3)
  vias: v1(19.63,67.02) v1(20.47,68.66) v1(21.22,68.7) v1(21.21,62.28) v1(21.21,61.47) v1(21.27,65.46) v1(21.27,63.06) v1(21.34,60.58) v1(22.05,63.08) v1(22.07,62.26) v1(22.07,61.46) v1(24.47,68.67) v2(30.67,40.59)
+1V8: length 137.4
  Top Layer w0.1: C35.1 34.29,88.22 34.28,88.23 34.28,89.33 P1.11 ; 32.05,86.44 31.93,86.57 R39.2 ; 32.05,86.44 31.72,86.44 30.12,84.84 29.34,84.84 29.21,84.97 29.21,85.97 29.21,85.98 R38.2 ; 32.05,86.44 32.29,86.21 33.87,86.21 34.18,86.53 34.18,86.71 34.6,87.12 34.6,87.5 34.4,87.7 ; v1(25.25,70.28) 25.25,70.03 25.24,70.02 25.24,69.7 25.25,69.69 25.25,69.49 U1.F10 U1.F11
  Top Layer w0.254: C29.1 37.49,20.45 38.54,19.4 NOREF#9.55 C32.2
  Top Layer w0.3: P1.11 34.18,91.3 v2(33.66,91.83)
  Top Layer w2: U8.2 37,20.93 35.78,20.93 34.67,22.05 34.67,24.39 37.08,26.8 v2(39.62,26.8)
  Inner3 w0.5: 30.92,71.63 26.58,71.63 25.43,70.48 25.43,70.45 v1(25.25,70.28) 23.72,70.28 22.91,69.46 v1(22.87,69.46)
  Inner3 w1: 30.96,71.35 32.51,72.9 32.51,75.19 27.43,80.27 27.43,91.48 28.75,92.8 32.68,92.8 v2(33.66,91.83)
  Inner3 w2: 30.96,71.35 31.43,70.87 39.62,70.87 ; v2(39.62,26.8) 44.2,26.8 v2(48.39,30.99) v2(48.39,50.72) 48.39,54.35 42.53,60.21 42.53,68.1 39.88,70.74
  Bottom Layer w0.1: C63.1 22.8,69.53 v1(22.87,69.46) 22.48,69.07 C62.1
+2V5: length 92.1
  Top Layer w0.1: U1.G11 25.57,68.26 v1(25.17,67.86) ; v1(22.03,64.67) 22.03,64.67 U1.L7
  Top Layer w0.5: C65.2 27.37,4.21 R41.2
  Top Layer w1: C67.2 C68.2 34.29,6.6 L3.2 ; C65.2 29.72,5.34 L3.2 ; L3.2 32.89,8.51 v2(32.89,11.05)
  Inner2 w0.2: v1(25.17,66.26) 23.59,64.67 v1(22.03,64.67)
  Inner2 w0.5: v1(25.17,67.86) v1(25.17,66.26)
  Inner2 w0.7: v1(25.17,67.86) 25.26,67.95 28.19,67.95
  Inner2 w1: 32.64,63.51 28.19,67.95
  Inner2 w1.5: v2(32.89,11.05) 32.89,11.06
  Inner2 w2: 32.89,11.06 32.89,28.2 42.54,37.85 42.54,48.39 32.64,58.3 32.64,63.51
+2V8: length 143.5
  Top Layer w0.1: P1.4 30.68,88.41 C34.1 ; P1.24 40.77,89.34 C74.1
  Top Layer w0.3: P1.24 40.68,91 37.93,93.75 33.43,93.75 30.68,91 P1.4
  Top Layer w0.5: 41.84,2.67 41.84,1.73 42.03,1.53 ; 42.03,1.53 L4.2 49.21,5.59 C73.2 ; 42.03,1.53 42.09,1.47 ; 42.03,1.53 C70.2 ; 49.47,5.34 C72.2
  Top Layer w1: 46.1,5.59 v2(46.1,8.89)
  Inner2 w1.5: v2(35.69,93.73) 36.96,92.46 43.18,92.46 v2(45.85,89.79) 50.04,85.6 v2(54.61,85.6) 58.8,81.41 v2(58.8,70.13) 57.26,68.59 57.26,51.97 v2(54.61,49.32) v2(54.61,30.19) 54.61,27.32 v2(49.15,21.86) 49.15,13.21 46.1,10.16 v2(46.1,8.89)
+3V3: length 107.8
  Top Layer w0.1: R23.1 10.76,64.41 v1(10.67,64.41) ; U1.J11 26.02,67.06 v1(26.03,67.06) 25.63,67.46 U1.H11 ; v1(7.11,74.55) 8.14,74.55 R17.2 ; U1.F6 21.89,69.33 v1(21.89,69.38) 22.1,69.38 U1.F7 ; U1.J7 22.73,66.35 22.73,66.3 ; U1.H7 22.47,67.46 v1(22.82,67.81) 23.03,67.81 23.06,67.84 23.38,67.84 23.43,67.8 23.56,67.8 U1.G9 ; R21.2 18.34,18.75 v1(18.29,18.8) ; R20.2 v1(5.97,76.58) ; v1(40.22,72.75) 40.29,72.75 40.46,72.57 U5.49 ; U1.K11 25.62,65.73 25.53,65.64 25.53,65.54 25.62,65.44 U1.L11 25.27,65.41 25.15,65.41 ; 11.82,76.08 11.82,74.68 ; v1(20.37,65.46) 20.4,65.43 20.4,64.94 20.69,64.65 21.21,64.65 U1.L6 ; R19.2 v1(4.19,76.84) ; C14.1 58.05,60.28 58.05,60.4 58.17,60.51 58.28,60.51 58.36,60.59 v1(58.36,60.71) ; R16.2 v1(8.76,72.14) ; U1.J6 21.95,66.99 v1(21.95,67.06) 21.95,67.13 U1.H6 ; R18.2 v1(5.59,77.47)
  Top Layer w0.254: R4.1 v1(28.32,24.01) ; C14.1 57.34,60.2 U5.27 ; U9.1 U9.4 12.11,62.83 v1(11.94,63) ; R21.2 R22.2 ; v1(45.04,72.81) 45.26,72.6 U5.43 ; v1(42.18,57.8) 42.86,58.48 U5.9 ; C8.1 60.06,66.04 v1(60.83,66.04) ; R3.1 28.32,32.34 v1(28.32,33.15) ; U5.14 v1(46.86,57.79) ; 9.27,21.61 9.14,21.49 v1(9.14,18.67) 9.96,18.67 R7.2 15.14,19.26 R5.2 ; 36.46,60.4 36.46,59.19 v1(37.21,58.44) 38.06,59.3 U5.3 ; v1(49.28,75.57) R1.2
  Top Layer w0.8: 8.92,85.14 v1(8.92,83.7)
  Top Layer w1: R89.1 34.8,10.98 34.8,11.77 33.8,12.77 C22.2 v1(31.24,12.77) C23.2 v1(28.32,12.77) v2(27.19,12.77) v1(25.71,12.77) 24.31,12.77 R11.2 24.2,12.77 C19.2 19.7,12.77 v1(19.17,12.23) 17.73,10.8 L1.2
  Inner2 w0.1: v1(22.82,67.81) 23.59,67.04 23.59,66.97 22.96,66.34 v1(22.73,66.34) 22.01,67.06 v1(21.95,67.06)
  Bottom Layer w0.1: 25.78,66.24 C55.1 v1(26.03,67.06) ; v1(23.57,71.86) 24.51,70.93 24.63,70.93 24.83,70.73 C39.1 24.75,70.53 24.75,70.42 24.56,70.23 C50.1 ; C16.2 40.81,73.27 40.7,73.27 40.58,73.15 40.58,73.11 v1(40.22,72.75) ; C12.1 42.18,58.34 v1(42.18,57.8) ; 27.75,71.38 27.75,71.19 v1(26.85,70.28) ; C40.1 26.82,68.71 v1(26.87,68.66) 27.29,68.66 C59.1 ; C57.1 22.83,66.34 v1(22.73,66.34) ; C37.1 21.21,70.68 v1(21.21,70.29) ; C47.1 24.19,67.31 C46.1 23.73,67.4 23.73,67.51 23.62,67.63 23,67.63 v1(22.82,67.81) 22.65,67.64 C45.1 ; C51.1 20.32,65.41 v1(20.37,65.46) ; C11.1 38.27,58.44 37.53,58.44 37.52,58.44 v1(37.21,58.44) ; C13.1 45.57,57.65 45.65,57.57 46.65,57.57 v1(46.86,57.79) ; v1(25.19,65.45) 25.28,65.45 26.48,64.25 C48.1 ; v1(20.44,66.29) 20.43,66.3 C56.1
  Bottom Layer w0.254: v1(58.36,60.71) 60.83,63.18 v1(60.83,66.04) ; v1(45.04,72.81) 45.97,72.81 46.66,73.51 47.22,73.51 v1(49.28,75.57)
  vias: v1(11.79,74.65) v1(19.56,13.09) v1(19.87,12.32) v1(22.35,13.09) v1(22.61,12.45) v1(22.99,12.96) v1(25.4,12.2) v1(26.16,13.21) v1(26.16,12.32)
+5V: length 41.7
  Top Layer w0.254: C30.1 38.68,22.86
  Top Layer w0.4: USB1.B4A9 5.58,8.27 3.77,10.07 3.77,11.28 5.57,13.07 USB1.A4B9
  Top Layer w0.5: 41.95,21.85 v3(41.95,22.74) ; C20.2 13.02,6.12 v2(11.45,4.56) ; C71.2 37.21,7.94 v2(37.21,7.26) 37.21,5.85 37.47,5.59 U12.2 ; U11.3 24.59,7.43 v2(23.39,7.43) C66.2
  Top Layer w0.6: U7.2 U7.3 33.34,34.63 C26.2 ; v2(7.75,8.39) 7.63,8.27 USB1.B4A9 ; v2(7.75,13.07) USB1.A4B9
  Top Layer w0.7: U11.2 U11.3
  Top Layer w1: C33.2 7.75,6.5 v2(7.75,8.39) ; U12.3 38.27,5.59 ; U8.3 38.27,22.78 38.35,22.86 38.68,22.86 39.44,23.63 40.19,23.63 40.96,22.86 41.82,22.86 v3(41.95,22.74) ; 16.08,16.74 16.08,16.26 ; 16.08,16.74 v2(17.4,16.74) ; 16.08,16.74 U6.3
  Top Layer w2: 33.18,33.91 v2(31.56,32.29) 30.67,31.4 v2(30.67,31.12)
  Bottom Layer w0.3: 6.44,13.09 7.73,13.09 v2(7.75,13.07)
  Bottom Layer w1: C75.2 7.37,8.77 v2(7.75,8.39)
  vias: v2(3.81,12.45) v2(3.76,10.67) v2(3.94,8.39)
GND: length 209
  Top Layer w0.1: 33.04,86.69 R35.2 ; 33.04,86.69 v1(33.78,86.69) ; 33.04,86.69 33.66,87.31 C35.2 ; C74.2 40.14,87.82 v1(40.13,87.82) 40.13,89.37 P1.23 ; R40.1 v1(28.7,2.42) ; R46.1 35.19,2.55 v1(36.07,3.43) ; 7.87,21.61 8,21.48 v1(8,20.32) ; C72.1 50.74,2.67 v1(50.74,4.09) C73.1 ; USB2.A1B12 16.8,5.47 USB2.1 15.5,6.23 C20.1 14.42,5.01 R43.2 R42.2 14.44,1.32 USB2.3 ; P1.26 v1(25.65,91.68) ; 52.07,39.81 v1(52.07,38.87) ; 36.07,4.76 v1(36.07,3.43) ; v1(36.07,3.43) 35.62,3.43 34.29,4.76 ; v1(29.72,90.56) 29.72,89.46 P1.2 ; v1(26.02,69.51) 26.03,69.52 v1(26.03,70.23) ; LED1.1 39.2,13.04 v1(38.74,12.58) ; 36.18,89.42 36.21,89.39 36.21,88.23 36.19,88.21 36.19,87.89 ; 52.2,46.16 v1(52.2,46.99) ; R9.1 9.53,15.14 v1(9.48,15.19) ; USB2.2 24.32,6.05 USB2.B1A12 ; U1.T1 18,61.44 20.44,61.44 U1.T5 ; v1(9.78,10.93) 9.26,10.93 R10.1 ; 11.56,6.1 v1(11.3,6.35) ; U10.4 62.37,39.64 v1(62.36,39.63) ; C71.1 v1(35.37,9.66) ; v1(29.72,35.56) 30.62,35.56 R14.1 ; R45.1 23.11,10.54 v1(22.48,9.91) 22.48,8.96 C66.1 ; U1.D2 18.85,70.23 19.06,70.23 19.06,70.24 20.18,70.24 20.19,70.23 20.45,70.23 ; v1(16.13,62.61) 16.13,62.66 16.55,63.08 18.04,63.08 U1.N2 ; U11.4 27.65,7.41 v1(28.32,6.74) ; v1(41.02,3.81) 41.02,4.59 U12.4 ; U1.J8 23.97,66.66 ; 17.78,67.57 18.02,67.81 v1(18.02,67.82) ; v1(27.62,64.61) 27.76,64.61 27.79,64.64 28.18,64.64 28.4,64.42 28.4,64.03 28.82,63.61 U1.N15 ; R25.1 19.63,56.01 v1(19.3,56.01) ; P1.25 42.33,93.82 v1(42.29,93.86) ; v1(29.61,85.81) 29.61,85.87 29.94,86.2 29.94,87.02 29.97,87.05 C34.2 ; U1.K8 U1.K7 ; U10.2 v1(62.37,46.49) ; C14.2 v1(59.18,60.2)
  Top Layer w0.254: C8.2 v1(59.31,63.25) ; 8,39.11 7.87,39.23 v1(7.87,40.39) NOREF#7.55 ; U1.A1 17.62,73.25 v1(18.03,73.66) ; U1.H16 30.1,67.46 ; 28.45,70.36 28.52,70.36 U1.D15 ; NOREF#12.55 v1(9.78,10.93) ; U5.28 57.28,71.57 v1(57.28,72.9) ; R24.1 v1(8.08,66.67) ; U1.T12 26.61,61.06 26.76,60.91 26.76,60.87 27.03,60.6 27.55,60.6 v1(27.62,60.53) ; U6.4 13.01,16.84 12.72,16.84 12.71,16.83 v1(11.84,16.83) ; U5.12 45.26,60.87 44.68,61.45 44.65,61.45 v1(44.25,61.85) ; v1(36.83,72.9) 36.83,72.52 36.73,72.43 36.73,71.96 36.46,71.69 ; USB1.4 USB1.2 6.17,6.93 USB1.B1A12 ; v1(42.54,72.65) 42.86,72.33 U5.46 ; U1.T1 17.62,57.69 v1(19.3,56.01) ; U1.A16 v1(30.1,73.54) ; USB1.3 USB1.1 6.17,14.42 USB1.A1B12 6.39,14.09 v1(7.07,14.09) ; v1(37.46,16.9) NOREF#8.55 U8.1 ; U1.G8 23.57,68.61 23.57,68.71 U1.F8 23.48,69.31 v1(23.61,69.31) 23.77,69.31 U1.F9 ; U1.K9 24.4,66.24 v1(24.4,66.38) ; U1.J9 23.97,66.66 v1(23.51,66.2) 23.51,66.15 U1.K8 ; v1(15.82,84.29) 15.82,82.64 ; C17.1 8.12,20.2 v1(8,20.32) ; v1(13.59,26.73) 14.32,27.46 v1(14.32,28.11) 14.32,28.86 v1(14.89,28.86) 15.72,28.86 v1(15.72,28.14) 15.72,27.46 v1(16.34,27.46) 17.12,27.46 v1(17.12,28.18) v1(17.12,29.54) 17.12,30.26 v1(16.27,30.26) U2.41 v1(14.89,30.26) 14.32,30.26 ; U5.6 40.46,59.52 v1(40,59.06) ; v1(24.4,66.38) 24.64,66.14 24.64,66.04 U1.K10 ; v1(24.4,66.38) 24.68,66.66 U1.J10 ; U1.G10 24.44,67.88 v1(24.44,67.73) ; v1(24.44,67.73) 24.17,67.46 U1.H9 U1.H8 ; v1(24.44,67.73) 24.55,67.73 U1.H10 ; v1(13.46,57.63) 13.46,57.97 U9.2 ; 38.06,71.69 v1(38.06,72.9) ; CARD1.9 v1(3.9,90.84) ; U1.T16 v1(29.97,60.71) ; U1.K7 22.28,65.72 21.76,65.72 U1.K6 ; 6.72,85.14 6.72,86.34 v1(6.49,86.57) ; CARD1.12 v1(17.4,90.84) ; C33.1 v1(11.3,6.35) ; 46.86,71.69 v1(46.86,70.11) ; 2.22,82.64 v1(2.22,84.34)
  Top Layer w0.4: C26.1 35.69,34.86 35.69,35.29 35.81,35.42 ; 35.81,35.42 35.9,35.5 U7.4 ; 35.81,35.42 v1(35.81,35.44)
  Top Layer w1: v1(29.5,48.18) 31.35,48.18 C27.1 C28.1 35.37,48.2 v1(35.43,48.26) ; 30.03,14.17 C23.1 ; 30.03,14.17 C22.1 33.15,14.29 v2(36.06,14.29) ; 30.03,14.17 28.46,15.74 R12.1
  Bottom Layer w0.1: v1(44.25,61.85) 45.73,60.37 45.73,57.93 ; 26.35,71.38 26.35,70.55 v1(26.03,70.23) ; 19.62,65.77 19.62,66.3 19.66,66.3 19.7,66.34 19.7,66.49 20.26,67.05 v1(20.41,67.05) 19.63,67.82 C61.2 ; 19.62,65.77 19.71,65.86 21.58,65.86 C54.2 ; 19.62,65.77 19.36,65.52 C51.2 ; v1(22.81,67.03) 22.59,67.25 C45.2 ; C40.2 25.97,69.45 v1(26.02,69.51) 25.3,69.51 25.28,69.53 24.9,69.53 24.78,69.41 24.78,69.3 C43.2 ; v1(46.86,70.11) 45.59,71.38 C15.1 ; C55.2 26.99,66.95 25.97,65.93 25.86,65.93 C52.2 ; C55.2 27.56,67.06 ; C55.2 26.99,67.17 26.69,67.47 26.08,67.47 25.71,67.84 C44.2 ; C48.2 25.99,64.25 25.87,64.25 25.63,64.48 25.19,64.48 24.64,65.03 24.64,65.44 24.76,65.56 24.76,66.11 24.64,66.23 24.55,66.23 v1(24.4,66.38) ; 21.84,68.27 22.16,68.58 22.42,68.58 C62.2 22.94,68.64 v1(23.61,69.31) ; v1(42.54,72.65) 42.23,72.96 40.89,72.96 ; C63.2 22.86,69.92 C50.2 ; 24.61,66.58 v1(24.4,66.38) ; 24.61,66.58 23.66,66.58 C57.2 23.48,66.76 23.48,67.26 C46.2 ; 24.61,66.58 24.73,66.58 24.83,66.68 C47.2 ; v1(24.4,66.38) 24.17,66.38 23.89,66.1 23.89,65.96 ; 23.89,65.96 24,65.85 ; 23.89,65.96 23.65,66.2 v1(23.51,66.2) 23.11,65.81 23.11,65.72 23.24,65.6 23.24,65.26 23.11,65.14 23.22,65.03 23.46,65.03 23.49,65 23.71,65 C53.2 ; 23.89,65.96 24.02,65.96 C49.2 ; v1(23.61,69.31) 23.61,69.8 23.49,69.92 23.37,69.92 23.26,70.04 23.26,70.15 C50.2 ; v1(23.61,69.31) 23.61,68.6 ; v1(20.45,70.24) 20.76,70.55 C37.2 ; C76.2 6.03,14.56 USB1.1 ; C10.2 C11.2 39.69,58.75 v1(40,59.06) 41.85,59.06 C12.2 ; C50.2 23.26,70.32 23.26,70.43 23.44,70.62 C39.2 ; C59.2 27.8,69.67 v1(28.45,70.31)
  Bottom Layer w0.5: USB1.2 5.6,7.25 5.83,7.48 5.83,8.08 5.6,8.31 5.6,8.59 C75.1
  vias: v1(0.51,93.98) v1(0.51,92.08) v1(0.51,63.76) v1(0.5,62.61) v1(0.51,56.65) v1(0.51,49.41) v1(0.51,48.14) v1(0.51,46.74) v1(0.51,44.83) v1(0.51,43.06) v1(0.51,41.28) v1(0.51,36.33) v1(0.51,34.04) v1(0.51,31.63) v1(0.51,29.72) v1(0.51,27.18) v1(0.51,25.78) v1(0.51,24.13) v1(0.51,22.48) v1(0.51,20.83) v1(0.51,19.44) v1(0.51,17.66) v1(0.51,16.39) v1(0.51,13.85) v1(0.51,12.96) v1(0.51,11.81) v1(0.51,9.66) v1(0.51,8.64) v1(0.51,7.75) v1(0.51,4.96) v1(0.51,3.56) v1(0.51,2.54) v1(0.51,1.66) v1(0.64,89.54) v1(0.64,87.63) v1(0.64,85.86) v1(0.64,84.59) v1(0.64,83.06) v1(0.64,81.67) v1(0.61,60.71) v1(0.61,59.06) v1(0.61,54.61) v1(0.61,52.71) v1(0.61,50.93) v1(0.61,38.74) v1(0.59,10.67) v1(0.64,0.51) v1(0.76,80.01) v1(0.89,77.35) v1(0.89,76.2) v1(0.89,68.71) v1(0.89,67.31) v1(0.89,65.66) v1(1.02,78.62) v1(1.02,72.27) v1(1.02,70.74) v1(1.02,13.47) v1(1.02,12.32) v1(1.02,11.18) v1(1.02,10.16) v1(1.02,9.15) v1(1.02,8.26) v1(1.02,4.19) v1(1.14,74.3) v1(1.14,5.21) v1(1.27,7.37) v1(1.38,1.17) v1(3.05,93.73) v1(3.15,0.53) v1(5.08,93.73) v1(5.33,0.64) v1(7.49,0.64) v1(7.62,93.73) v1(7.62,3.69) v1(8.25,1.91) v1(8.89,0.64) v1(9.78,93.73) v1(9.78,3.05) v1(10.41,0.64) v1(11.05,1.91) v1(11.81,0.64) v1(12.19,93.6) v1(13.21,0.5) v1(14.35,93.6) v1(14.35,8.89) v1(14.73,0.51) v1(17.15,94.11) v1(17.4,1.02) v1(18.03,0.51) v1(18.82,69.43) v1(18.8,14.48) v1(18.8,1.02) v1(18.87,71.86) v1(19.3,93.98) v1(19.3,16.51) v1(19.56,0.51) v1(20.32,1.02) v1(20.96,28.2) v1(20.96,0.51) v1(21.34,94.11) v1(21.46,0.89) v1(22.22,0.51) v1(22.73,1.02) v1(22.86,28.33) v1(22.86,26.55) v1(23.11,16.13) v1(23.24,0.51) v1(23.37,94.11) v1(24.28,84.33) v1(25.02,87.38) v1(25.27,94.11) v1(26.29,58.93) v1(27.05,0.64) v1(27.57,67.06) v1(27.69,93.86) v1(27.67,62.26) v1(28.19,34.42) v1(28.57,0.64) v1(29.34,93.98) v1(29.72,91.95) v1(29.72,33.91) v1(30.1,67.46) v1(30.35,0.51) v1(31.12,93.98) v1(31.75,0.64) v1(32.13,90.94) v1(32.51,93.98) v1(33.53,0.64) v1(33.91,92.97) v1(34.16,94.37) v1(35.31,92.46) v1(36.21,87.89) v1(36.19,0.51) v1(36.45,12.32) v1(38.1,94.37) v1(38.35,14.86) v1(38.61,0.64) v1(38.99,28.71) v1(39.12,25.02) v1(39.75,0.51) v1(40.26,94.37) v1(40.39,14.86) v1(41.28,0.51) v1(41.78,11.94) v1(43.69,0.64) v1(44.32,94.37) v1(45.09,0.64) v1(46.23,65.16) v1(46.35,94.24) v1(46.61,0.64) v1(46.81,61.63) v1(47.88,9.02) v1(48.13,58.42) v1(48.13,0.64) v1(48.36,63.22) v1(48.51,94.24) v1(48.92,62.66) v1(49.25,58.32) v1(49.78,57.41) v1(50.16,58.04) v1(50.42,0.64) v1(50.55,62.23) v1(50.8,58.3) v1(51.05,61.73) v1(51.31,0.64) v1(51.44,94.24) v1(51.69,61.73) v1(51.69,58.3) v1(52.45,61.73) v1(52.45,58.3) v1(52.71,0.64) v1(52.96,94.24) v1(54.1,0.64) v1(54.23,94.24) v1(56.51,0.64) v1(58.42,0.64) v1(59.69,0.64) v1(60.58,94.24) v1(60.92,0.6) v1(62.1,94.24) v1(62.1,0.64) v1(62.4,43.06) v1(62.74,20.45) v1(62.74,17.28) v1(62.87,18.8) v1(62.87,14.99) v1(62.87,12.7) v1(62.87,11.05) v1(62.87,9.4) v1(62.99,86.62) v1(62.99,84.71) v1(62.99,83.06) v1(62.99,79) v1(62.99,30.99) v1(62.99,28.33) v1(62.99,25.91) v1(62.99,22.99) v1(63.12,48.77) v1(63.12,36.07) v1(63.12,33.53) v1(63.12,0.64) v1(63.25,50.93) v1(63.25,37.98) v1(63.37,94.24) v1(63.37,92.97) v1(63.37,91.19) v1(63.37,89.54) v1(63.37,87.63) v1(63.37,85.73) v1(63.37,84.08) v1(63.37,82.05) v1(63.37,80.14) v1(63.37,77.6) v1(63.37,75.44) v1(63.37,73.16) v1(63.37,70.74) v1(63.37,68.2) v1(63.37,65.66) v1(63.37,63.25) v1(63.37,61.47) v1(63.37,59.31) v1(63.37,57.15) v1(63.37,54.11) v1(63.37,52.45) v1(63.37,44.07) v1(63.37,41.91) v1(63.37,6.23) v1(63.37,3.07) v1(63.5,55.88)
(no net): length 10.6
  Top Layer w0.1: U2.4 11.91,21.38 v1(11.91,19.97) ; NOREF.55 10.41,39.63 10.41,39.11 ; 20.57,39.11 20.57,39.74 22.11,41.28 22.73,41.28 22.99,41.03 ; U2.39 9.14,40.39 NOREF#6.55
  Bottom Layer w0.1: NOREF#11.1 11.91,18.2 v1(11.91,19.97)
CCLK: length 6.4
  Top Layer w0.1: v1(26.82,62.31) 26.82,62.48 26.84,62.5 26.84,63.58 26.58,63.84 26.26,63.84 26,64.1 26,64.42 25.78,64.64 25.28,64.64 25.27,64.65 25.21,64.65 25.2,64.64 24.66,64.64 24.44,64.42 24.44,63.88 U1.N9
  Bottom Layer w0.1: v1(26.82,62.31) 26.92,62.21 R6.1
CRYSTAL: length 5.6
  Top Layer w0.4: U9.3 14.31,61.86 16.71,64.26 16.75,64.26 16.76,64.26 U1.M1
D0: length 21.1
  Top Layer w0.1: U1.E2 18.04,70.24 17.46,70.24 17.2,69.98 14.48,69.98 ; v1(0.89,64.27) 1.14,64.01 R26.1
  Bottom Layer w0.1: v1(14.49,69.98) 6.6,69.98 v1(0.89,64.27)
D1: length 21.2
  Top Layer w0.1: v1(2.03,64.27) 2.29,64.01 R27.1 ; v1(17.02,69.38) 17.14,69.38 U1.E1
  Bottom Layer w0.1: v1(17.02,69.38) 16.39,69.38 16.21,69.55 8.18,69.55 8,69.38 7.14,69.38 4.23,66.47 4.13,66.47 3.91,66.68 3.81,66.68 3.63,66.5 3.63,66.4 3.85,66.18 3.85,66.08 3.67,65.9 3.57,65.9 3.35,66.12 3.25,66.12 3.06,65.93 3.06,65.83 3.28,65.62 3.28,65.52 3.1,65.33 3,65.33 2.78,65.55 2.68,65.55 2.5,65.37 2.5,65.27 2.72,65.05 2.72,64.95 v1(2.03,64.27)
D2: length 21.1
  Top Layer w0.1: v1(18.03,69.43) 18.05,69.43 U1.F2 ; v1(3.17,64.27) 3.43,64.01 R28.1
  Bottom Layer w0.1: v1(3.17,64.27) 3.43,64.52 3.43,64.62 3.33,64.72 3.33,64.82 3.51,65.01 3.61,65.01 3.71,64.9 3.81,64.9 3.99,65.09 3.99,65.19 3.89,65.29 3.89,65.39 4.07,65.57 4.17,65.57 4.28,65.47 4.38,65.47 4.56,65.65 4.56,65.75 4.46,65.86 4.46,65.96 4.64,66.14 4.74,66.14 4.84,66.03 4.94,66.03 5.13,66.22 5.13,66.32 4.97,66.47 4.97,66.57 5.16,66.75 5.25,66.75 5.41,66.6 5.51,66.6 5.69,66.78 5.69,66.88 5.54,67.04 5.54,67.14 5.72,67.32 5.82,67.32 5.97,67.17 6.07,67.17 8.26,69.35 15.96,69.35 16.07,69.24 16.24,69.24 16.51,68.97 17.18,68.97 17.64,69.43 v1(18.03,69.43)
D3: length 21.1
  Top Layer w0.1: U1.F1 17.6,69.08 17.42,69.08 17.06,68.72 16.72,68.72 16.49,68.95 v1(15.79,68.95) ; R29.1 4.32,63.68 v1(4.32,64.27)
  Bottom Layer w0.1: v1(4.32,64.27) 4.64,64.59 4.64,64.69 4.42,64.9 4.42,65 4.6,65.19 4.7,65.19 4.82,65.07 4.92,65.07 5.11,65.25 5.11,65.35 4.99,65.47 4.99,65.57 5.17,65.75 5.27,65.75 5.49,65.53 5.59,65.53 5.77,65.72 5.77,65.82 5.55,66.03 5.55,66.13 5.73,66.32 5.83,66.32 6.05,66.1 6.15,66.1 6.2,66.15 6.2,66.25 6.42,66.46 6.42,66.56 6.25,66.73 6.25,66.83 6.43,67.01 6.53,67.01 6.7,66.84 6.8,66.84 6.98,67.03 6.98,67.13 6.81,67.3 6.81,67.4 7,67.58 7.1,67.58 7.26,67.41 7.36,67.41 7.55,67.59 7.55,67.69 7.38,67.86 7.38,67.96 7.56,68.14 7.66,68.14 7.83,67.97 7.93,67.97 8.11,68.16 8.11,68.26 7.94,68.43 7.94,68.53 8.13,68.71 8.23,68.71 8.4,68.54 8.5,68.54 8.7,68.75 8.8,68.75 9,68.95 9.4,68.95 9.47,69.02 9.47,69.05 9.54,69.12 9.8,69.12 9.87,69.05 9.87,69.02 9.94,68.95 10.2,68.95 10.27,69.02 10.27,69.05 10.34,69.12 10.6,69.12 10.67,69.05 10.67,69.02 10.74,68.95 v1(15.79,68.95)
D4: length 21
  Top Layer w0.1: v1(5.59,64.27) 5.59,63.56 R30.1 ; U1.G2 18.02,68.66 v1(18.02,68.66)
  Bottom Layer w0.1: v1(5.59,64.27) 5.59,65.25 5.73,65.4 5.75,65.4 6.16,64.99 6.26,64.99 6.45,65.17 6.45,65.27 6.03,65.68 6.03,65.7 6.3,65.97 6.32,65.97 6.73,65.55 6.83,65.55 7.01,65.74 7.01,65.84 6.6,66.25 6.6,66.35 6.78,66.53 6.88,66.53 7.25,66.17 7.35,66.17 7.53,66.35 7.53,66.45 7.24,66.74 7.24,66.9 7.66,67.33 7.76,67.33 7.93,67.16 8.03,67.16 8.22,67.34 8.22,67.44 8.05,67.61 8.05,67.71 9.09,68.75 15.42,68.75 15.63,68.55 15.96,68.55 16.09,68.68 16.19,68.68 16.65,68.22 17.58,68.22 v1(18.02,68.66)
D5: length 21.1
  Top Layer w0.1: v1(6.6,64.27) 6.86,64.01 R31.1 ; U1.G1 17.06,67.69 v1(17.05,67.69)
  Bottom Layer w0.1: v1(6.6,64.27) 6.78,64.44 6.88,64.44 7.39,63.94 7.49,63.94 7.67,64.12 7.67,64.22 7.17,64.73 7.17,64.83 7.35,65.01 7.45,65.01 7.96,64.5 8.06,64.5 8.24,64.68 8.24,64.78 7.73,65.29 7.73,65.39 7.89,65.56 8,65.56 8.41,65.14 8.51,65.14 8.69,65.33 8.69,65.43 8.28,65.84 8.28,65.94 8.48,66.14 8.48,66.4 8.55,66.47 8.59,66.47 8.66,66.54 8.66,66.8 8.59,66.87 8.55,66.87 8.48,66.94 8.48,67.2 8.55,67.27 8.59,67.27 8.66,67.34 8.66,67.6 8.59,67.67 8.55,67.67 8.48,67.74 8.48,67.81 8.92,68.26 8.95,68.26 9.04,68.35 9.52,68.35 9.59,68.42 9.59,68.45 9.66,68.52 9.92,68.52 9.99,68.45 9.99,68.42 10.06,68.35 10.32,68.35 10.39,68.42 10.39,68.45 10.46,68.52 10.72,68.52 10.79,68.45 10.79,68.42 10.86,68.35 11.12,68.35 11.19,68.42 11.19,68.45 11.26,68.52 11.52,68.52 11.59,68.45 11.59,68.42 11.66,68.35 11.92,68.35 11.99,68.42 11.99,68.45 12.06,68.52 12.32,68.52 12.39,68.45 12.39,68.42 12.46,68.35 12.72,68.35 12.79,68.42 12.79,68.45 12.86,68.52 13.12,68.52 13.19,68.45 13.19,68.42 13.26,68.35 13.52,68.35 13.59,68.42 13.59,68.45 13.66,68.52 13.92,68.52 13.99,68.45 13.99,68.42 14.06,68.35 15.85,68.35 15.94,68.26 16.17,68.26 16.82,67.61 16.96,67.61 v1(17.05,67.69)
D6: length 20.8
  Top Layer w0.1: U1.J1 17.6,66.68 v1(16.89,66.68) ; R32.1 8,63.95 8.72,64.67 9.06,64.67 9.29,64.43 9.29,64.33 v1(9.69,63.93)
  Bottom Layer w0.1: v1(9.69,63.93) 9.5,64.12 9.5,64.32 9.57,64.39 9.84,64.39 9.91,64.46 9.91,64.72 9.84,64.79 9.57,64.79 9.5,64.86 9.5,65.12 9.57,65.19 10.6,65.19 10.67,65.26 10.67,65.52 10.6,65.59 9.57,65.59 9.5,65.66 9.5,65.92 9.57,65.99 10.22,65.99 10.29,66.06 10.29,66.32 10.22,66.39 9.57,66.39 9.5,66.46 9.5,66.59 9.87,66.95 11.08,66.95 11.15,66.88 11.15,66.62 11.23,66.55 11.48,66.55 11.55,66.62 11.55,66.88 11.63,66.95 11.88,66.95 11.95,66.88 11.95,66.62 12.03,66.55 12.28,66.55 12.35,66.62 12.35,66.88 12.43,66.95 12.68,66.95 12.75,66.88 12.75,66.62 12.83,66.55 13.08,66.55 13.15,66.62 13.15,66.88 13.23,66.95 13.48,66.95 13.55,66.88 13.55,66.62 13.63,66.55 13.88,66.55 13.95,66.62 13.95,66.88 14.03,66.95 15.35,66.95 15.47,66.83 16.3,66.83 16.44,66.68 v1(16.89,66.68)
D7: length 21.1
  Top Layer w0.1: R34.1 9.14,64.01 v1(8.89,64.27) ; v1(18.03,67.06) 18.03,67.05 U1.J2
  Bottom Layer w0.1: v1(8.89,64.27) 8.89,64.54 8.96,64.61 9.2,64.61 9.27,64.68 9.27,64.94 9.2,65.01 8.96,65.01 8.89,65.08 8.89,65.34 8.96,65.41 9.2,65.41 9.27,65.48 9.27,65.74 9.2,65.81 8.96,65.81 8.89,65.88 8.89,66.14 8.96,66.21 9.2,66.21 9.27,66.28 9.27,66.54 9.2,66.61 8.96,66.61 8.89,66.68 8.89,66.94 8.96,67.01 9.2,67.01 9.27,67.08 9.27,67.34 9.2,67.41 8.96,67.41 8.89,67.48 8.89,67.82 9.22,68.15 9.47,68.15 9.54,68.08 9.54,67.74 9.61,67.67 9.87,67.67 9.94,67.74 9.94,68.08 10.01,68.15 10.27,68.15 10.34,68.08 10.34,67.88 10.41,67.81 10.67,67.81 10.74,67.88 10.74,68.08 10.81,68.15 11.07,68.15 11.14,68.08 11.14,67.74 11.21,67.67 11.47,67.67 11.54,67.74 11.54,68.08 11.61,68.15 11.87,68.15 11.94,68.08 11.94,67.74 12.01,67.67 12.27,67.67 12.34,67.74 12.34,68.08 12.41,68.15 14.86,68.15 14.93,68.08 14.93,67.64 15,67.57 15.26,67.57 15.33,67.64 15.33,68.08 15.4,68.15 15.76,68.15 16.62,67.29 17.8,67.29 v1(18.03,67.06)
DIN: length 2.6
  Top Layer w0.254: v1(23.88,60.46) 23.27,61.06 U1.T8
  Bottom Layer w0.1: v1(23.88,60.46) 23.88,59.44 R87.1
DN: length 18.5
  Top Layer w0.1: v1(20.96,5.08) 20.96,5.92 USB2.A7
  Top Layer w0.254: 23.24,21.61 23.11,21.49 v1(23.11,20.45)
  Bottom Layer w0.1: v1(20.96,5.08) 20.96,15.88 23.11,18.04 v1(23.11,20.45)
DONE: length 33.3
  Top Layer w0.254: v1(24.44,62.29) 24.39,62.29 U1.P9 ; v1(27.05,38.36) 27.38,38.03 R3.2 25.79,32.26
  Bottom Layer w0.254: v1(24.44,62.29) 24.44,62.18 25.53,61.09 25.53,51.95 26.67,50.3 26.67,38.74 v1(27.05,38.36)
DOUT: length 2.2
  Top Layer w0.1: U1.M8 23.22,64 22.84,63.62 22.84,63.06 v1(22.82,63.05)
  Bottom Layer w0.1: v1(22.82,63.05) 22.86,63.01 R88.1
DP: length 20.1
  Top Layer w0.1: USB2.A6 20.32,5.08
  Top Layer w0.254: v1(22.48,19.82) 22.63,19.97 23.31,19.97 23.84,20.5 23.84,21.18 24.27,21.61 24.51,21.61
  Bottom Layer w0.1: v1(22.48,19.82) 22.25,19.58 22.25,18.76 22.01,18.53 21.95,18.53 20.28,16.85 20.28,11.32 19.92,10.97 19.92,10.63 20.28,10.27 v1(20.28,5.08)
FSCL: length 1.4
  Top Layer w0.1: U1.A10 25.15,73.38 v1(25.15,73.54)
  Bottom Layer w0.1: v1(25.15,73.54) 25.02,73.66 R72.1
FSDA: length 1.6
  Top Layer w0.1: v1(24.38,72.65) 24.38,72.62 U1.B9
  Bottom Layer w0.1: R71.1 23.88,73.16 v1(24.38,72.65)
HREF: length 1.7
  Top Layer w0.1: v1(26.16,73.92) 26.16,73.6 U1.A11
  Bottom Layer w0.1: v1(26.16,73.92) 26.16,74.37 R75.1
INITN: length 46.5
  Top Layer w0.254: v1(22.48,49.28) v1(18.29,45.09) ; v1(17.78,20.32) 17.53,20.07 R5.1 16.82,21.54 16.89,21.61 ; U1.T9 24.63,60.46 v1(24.64,60.46)
  Bottom Layer w0.254: v1(22.48,49.28) 24.03,50.83 24.03,57.94 24.64,58.55 v1(24.64,60.46) ; v1(17.78,20.32) NOREF#4.55 17.78,44.58 v1(18.29,45.09)
M_CLK: length 24
  Top Layer w0.1: v1(16.18,71.1) 16.2,71.08 22.04,71.08 U1.C7
  Top Layer w0.254: v1(7.87,79.63) 7.87,85.09 7.82,85.14
  Bottom Layer w0.254: v1(7.87,79.63) 8.09,79.63 16.18,71.53 v1(16.18,71.1)
M_CMD: length 25.6
  Top Layer w0.1: R20.1 v1(10.02,76.58)
  Top Layer w0.254: U1.B4 19.69,71.92 v1(19.69,71.89) ; 10.02,85.14 10.02,82.34 9.84,82.16 9.7,82.16 9.53,81.98 9.53,81.83 9.7,81.65 9.84,81.65 10.02,81.47 10.02,80.99 9.84,80.81 9.58,80.81 9.4,80.63 9.4,80.48 9.58,80.31 9.84,80.31 10.02,80.13 10.02,79.98 9.84,79.8 9.58,79.8 9.4,79.62 9.4,79.47 9.58,79.29 9.84,79.29 10.02,79.11 v1(10.02,76.58)
  Bottom Layer w0.254: v1(10.02,76.58) 10.53,76.58 15.71,71.41 15.71,70.9 15.99,70.62 16.38,70.62 16.58,70.82 18.62,70.82 v1(19.69,71.89)
M_D0: length 26.9
  Top Layer w0.1: v1(5.62,82.81) 5.59,82.78 R18.1
  Top Layer w0.254: v1(18.03,71.89) 18.05,71.89 U1.B2 ; 5.62,85.14 v1(5.62,82.81)
  Bottom Layer w0.254: v1(18.03,71.89) 17.95,71.89 17.47,71.41 17.07,71.41 16.08,72.4 16.08,72.66 16.29,72.87 16.29,73.12 16.19,73.23 15.93,73.23 15.72,73.01 15.47,73.01 15.36,73.12 15.36,73.37 15.57,73.58 15.57,73.84 15.47,73.94 15.21,73.94 15,73.73 14.75,73.73 14.64,73.84 14.64,74.09 14.85,74.3 14.85,74.56 14.75,74.66 14.5,74.66 14.28,74.45 14.03,74.45 13.92,74.56 13.92,74.81 14.14,75.02 14.14,75.28 14.03,75.38 13.78,75.38 13.57,75.17 13.31,75.17 13.01,75.47 13.01,75.88 12.85,76.03 12.45,76.03 5.67,82.81 v1(5.62,82.81)
M_D1: length 28.5
  Top Layer w0.1: v1(4.57,83.82) 4.19,83.44 R19.1
  Top Layer w0.254: v1(4.57,83.82) 4.57,85.09 4.52,85.14 ; U1.B1 17.27,71.91 v1(17.27,71.89)
  Bottom Layer w0.254: v1(4.57,83.82) 7.37,83.82 13.1,78.09 13.36,78.09 13.48,78.21 13.74,78.21 13.84,78.11 13.84,77.85 13.72,77.73 13.72,77.47 13.82,77.37 14.08,77.37 14.2,77.5 14.46,77.5 14.56,77.39 14.56,77.14 14.44,77.01 14.44,76.75 14.54,76.65 14.79,76.65 14.92,76.78 15.18,76.78 15.28,76.67 15.28,76.42 15.15,76.29 15.15,76.04 15.26,75.93 15.51,75.93 15.64,76.06 15.89,76.06 16,75.95 16,75.7 15.87,75.57 15.87,75.32 15.98,75.21 16.23,75.21 16.36,75.34 16.61,75.34 16.72,75.23 16.72,74.98 16.59,74.85 16.59,74.6 17.27,73.92 v1(17.27,71.89)
M_D2: length 25.4
  Top Layer w0.1: v1(12.57,72.27) 12.45,72.14 11.42,72.14
  Top Layer w0.254: v1(12.57,72.27) 12.5,72.34 12.5,84.86 12.22,85.14 ; v1(21.21,71.89) 21.25,71.89 U1.B6
  Bottom Layer w0.254: v1(12.57,72.27) 13.81,71.03 14.44,71.03 15.2,70.27 15.2,69.91 19.23,69.91 v1(21.21,71.89)
M_D3: length 25.2
  Top Layer w0.1: R17.1 v1(11.05,74.68)
  Top Layer w0.254: 11.12,85.14 11.05,85.08 v1(11.05,74.68) ; U1.B5 v1(20.45,71.89)
  Bottom Layer w0.254: v1(11.05,74.68) 11.06,74.68 11.91,73.83 12.4,73.83 12.51,73.72 12.51,73.23 12.63,73.12 13.12,73.12 13.23,73 13.23,72.51 13.34,72.4 13.84,72.4 13.95,72.29 13.95,71.79 14.24,71.5 14.6,71.5 15.84,70.26 19.09,70.26 20.45,71.62 v1(20.45,71.89)
MCLK: length 2.1
  Top Layer w0.1: U1.A12 26.56,73.2 26.56,73.94 v1(26.92,74.3)
  Bottom Layer w0.1: v1(26.92,74.3) 27.05,74.43 R77.1
PCLK: length 11.3
  Top Layer w0.1: U1.C8 23.22,71.32 23.46,71.08 26.62,71.08 26.84,71.29 26.84,71.65 27.06,71.88 27.38,71.88 27.6,72.1 27.6,72.69 v1(27.62,72.71)
  Bottom Layer w0.1: 30.05,77.17 30.05,76.87 29.82,76.65 29.82,76.07 28.23,74.48 28.23,73.31 v1(27.62,72.71)
PROGRAM: length 30.3
  Top Layer w0.1: v1(50.93,40.64) 52.04,40.64 R37.1 53.83,40.67 U10.3 ; U2.27 28.44,39.11 v1(28.45,39.12)
  Bottom Layer w0.1: v1(28.45,39.12) 49.4,39.12 v1(50.93,40.64)
PROGRAMN: length 42.2
  Top Layer w0.254: v1(28.32,26.69) R4.2 28.25,25.91 25.79,25.91 ; U1.R9 23.61,62.27 v1(23.59,62.27)
  Bottom Layer w0.254: v1(28.32,26.69) 24.38,30.63 NOREF#2.55 24.38,57.8 25.12,58.53 25.12,60.74 v1(23.59,62.27)
RESET: length 113.3
  Top Layer w0.1: v1(60.07,49.15) 57.81,49.15 U10.1 53.95,45.29 R36.1 v1(52.2,43.82) ; v1(28.45,41.15) 27.31,42.3 20.57,42.3 19.43,41.15 v1(19.43,41.03) ; P1.6 31.62,89.37 v1(31.62,88.02)
  Top Layer w0.254: 19.43,39.11 v1(19.43,41.03)
  Bottom Layer w0.1: v1(31.62,88.02) 31.85,88.24 31.85,89.64 33.02,90.81 41.78,90.81 61.34,71.25 61.34,50.68 60.07,49.41 v1(60.07,49.15) ; v1(52.2,43.82) 50.16,45.85 33.15,45.85 v1(28.45,41.15)
RX: length 39.7
  Top Layer w0.1: v1(14.35,66.35) 14.68,66.03 16.98,66.03 17.14,65.86 U1.K1 ; U2.36 12.45,38.6 v1(12.45,37.22)
  Bottom Layer w0.1: v1(14.35,66.35) 13.75,66.35 12.44,65.05 12.28,65.05 12.04,64.81 12.04,64.65 8.76,61.37 8.76,39.63 11.18,37.22 v1(12.45,37.22)
SCL: length 1.9
  Top Layer w0.254: 19.43,19.69 19.43,21.6 19.43,21.61
SD_A0: length 7
  Top Layer w0.1: U1.T6 21.75,61.06 R56.1
SD_A1: length 6
  Top Layer w0.1: R57.1 23.86,57.08 20.02,60.92 U1.T4
SD_A2: length 3.6
  Top Layer w0.1: U1.T3 19.22,61.05 R58.1
SD_A3: length 7.7
  Top Layer w0.1: R59.1 23.13,55.75 23.13,55.93 18.23,60.83 18.23,60.87 U1.T2
SD_A4: length 4.4
  Top Layer w0.1: R68.2 18.44,75.72 18.44,73.07 U1.A2
SD_A5: length 6
  Top Layer w0.1: U1.A3 19.22,74.85 22.17,77.8
SD_A6: length 3
  Top Layer w0.1: R66.2 20.07,73.92 20.07,73.1 U1.A4
SD_A7: length 5.7
  Top Layer w0.1: U1.A5 20.82,73.78 24.33,77.3
SD_A8: length 2.7
  Top Layer w0.1: U1.A6 21.62,73.7 R64.2
SD_A9: length 3.8
  Top Layer w0.1: 24.97,75.77 22.42,73.23 U1.A7
SD_A10: length 3.5
  Top Layer w0.1: 24.91,58.67 22.52,61.06 U1.T7
SD_A11: length 5.1
  Top Layer w0.1: 27,76.15 26.67,75.82 25.96,75.82 23.22,73.08 U1.A8
SD_A12: length 6.9
  Top Layer w0.1: U1.B7 22.84,72.68 23.38,72.68 23.6,72.9 23.6,73.18 25.81,75.39 R61.2
SD_BA0: length 1.5
  Top Layer w0.254: U1.K12 26.75,65.53 v1(26.8,65.53)
  Bottom Layer w0.1: 27.76,65.53 v1(26.8,65.53)
SD_BA1: length 6.1
  Top Layer w0.254: U1.L12 26.8,64.69 v1(26.8,64.65)
  Bottom Layer w0.1: v1(26.8,64.65) 26.19,65.25 26.19,65.78 26.93,66.52 28.13,66.52 28.28,66.68 R53.1
SD_CAS_N: length 2.3
  Top Layer w0.254: v1(27.62,61.51) 27.27,61.86 U1.R13
  Bottom Layer w0.1: 28.78,60.26 28.78,60.35 v1(27.62,61.51)
SD_CLK: length 2.9
  Top Layer w0.1: R2.2 29.22,67.06 U1.J15
SD_CS_N: length 5.3
  Top Layer w0.254: U1.R15 28.82,61.85 v1(28.45,61.47)
  Bottom Layer w0.1: R51.1 28.2,64.2 27.62,64.2 27.08,63.66 27.08,63.03 27.46,62.66 28.02,62.66 28.57,62.11 28.57,61.47 v1(28.45,61.47)
